# EAGLE design Thing_Plus_MGM240P (EAGLE 9.6.2)
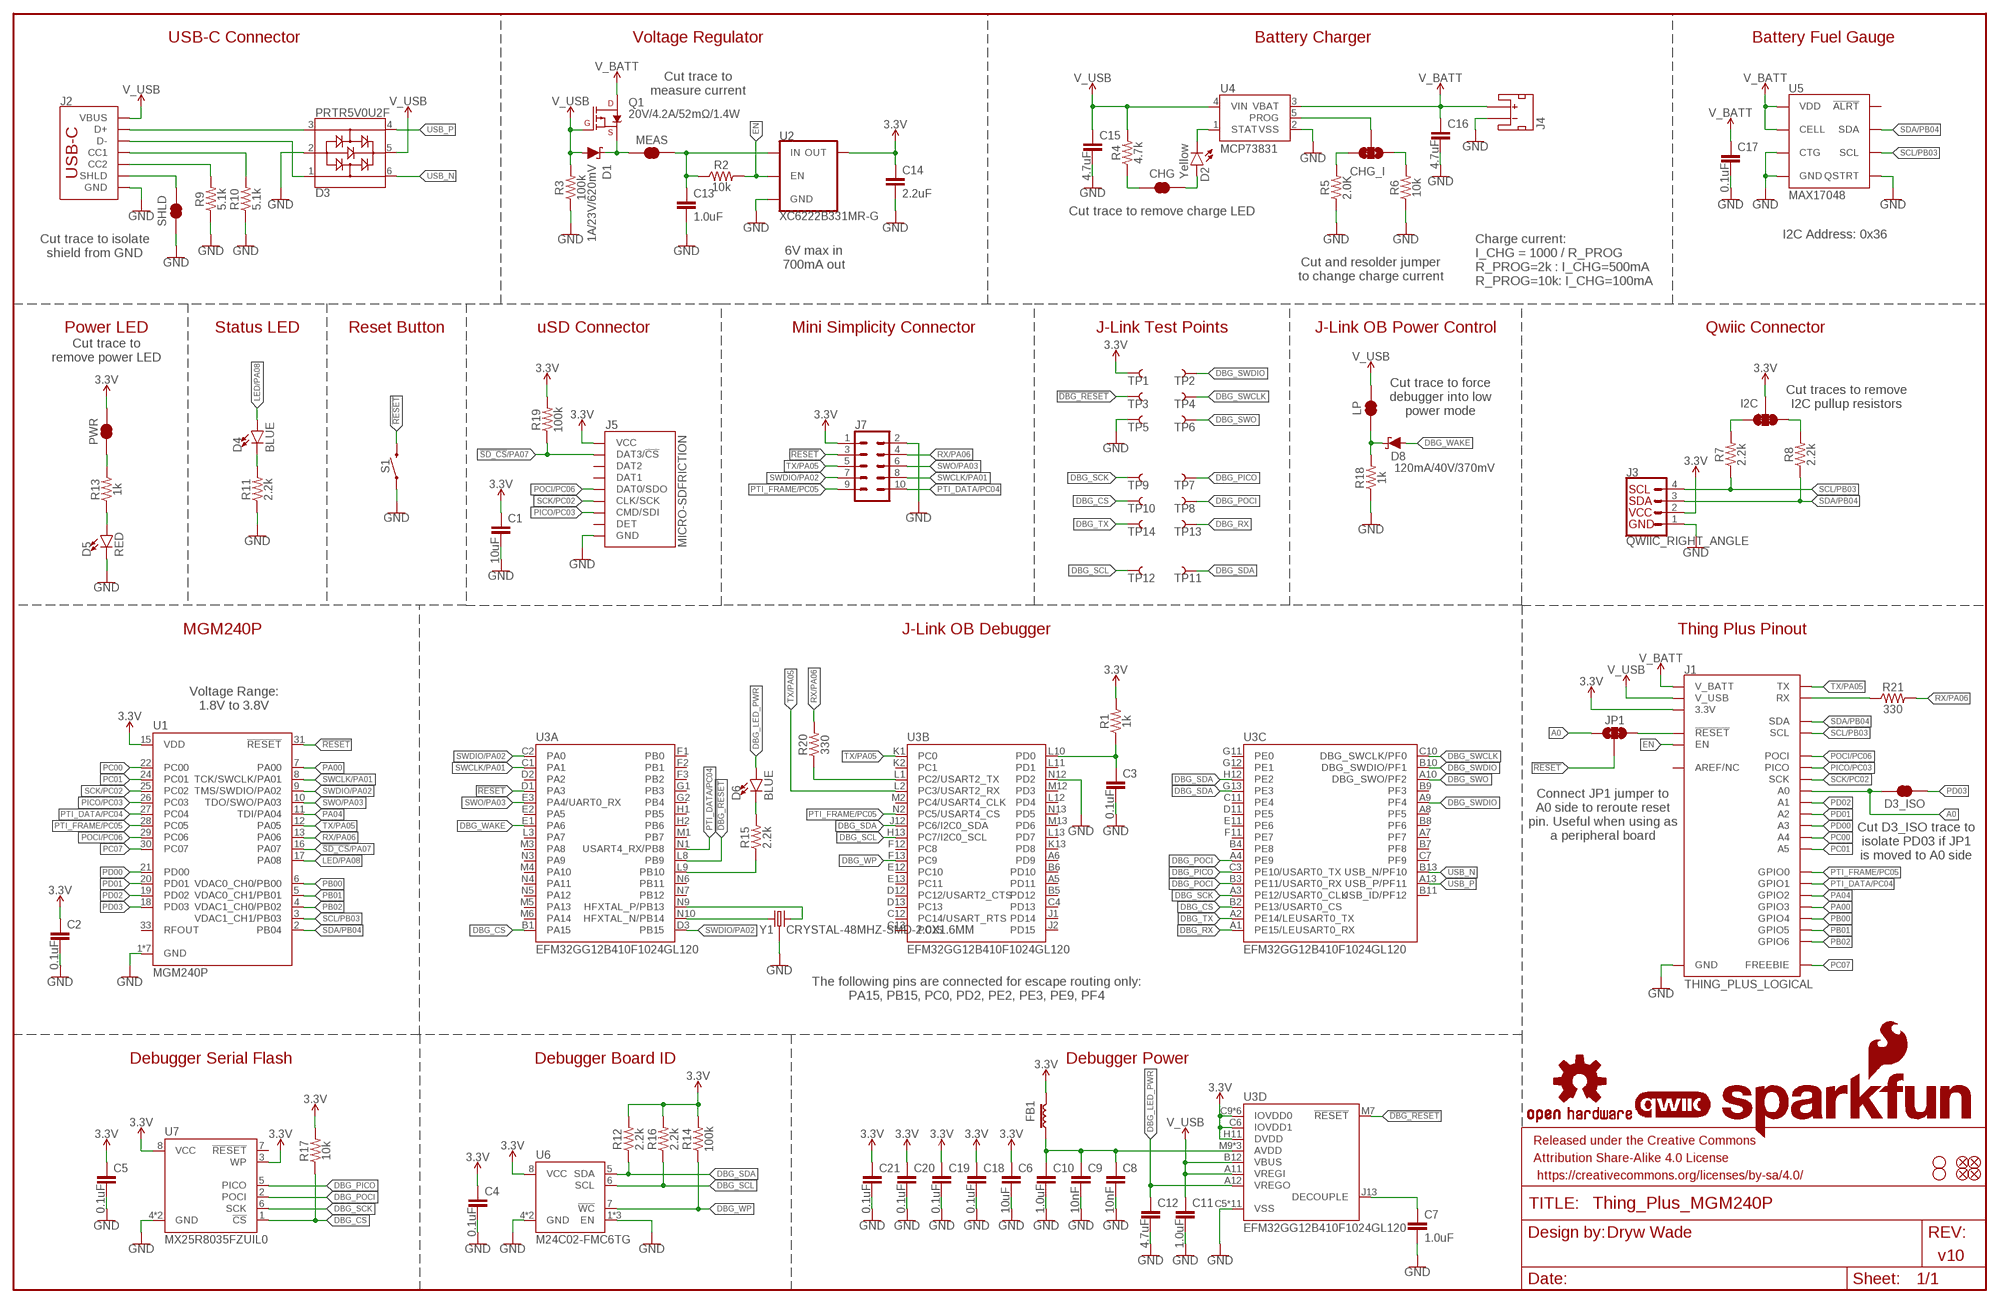
[diagram p0: schematic, sheet 1]

## Parts
C1  10uF  10UF-0402T-6.3V-20%  [0402-TIGHT]
C2  0.1uF  0.1UF-0402T-6.3V-10%-X7R  [0402-TIGHT]
C3  0.1uF  0.1UF-0402T-6.3V-10%-X7R  [0402-TIGHT]
C4  0.1uF  0.1UF-0402T-6.3V-10%-X7R  [0402-TIGHT]
C5  0.1uF  0.1UF-0402T-6.3V-10%-X7R  [0402-TIGHT]
C6  10uF  10UF-0402T-6.3V-20%  [0402-TIGHT]
C7  1.0uF  1.0UF-0603-16V-10%-X7R  [0603]
C8  10nF  10NF-0402T-25V-10%  [0402-TIGHT]
C9  10nF  10NF-0402T-25V-10%  [0402-TIGHT]
C10  1.0uF  1.0UF-0402T-16V-10%  [0402-TIGHT]
C11  1.0uF  1.0UF-0402T-16V-10%  [0402-TIGHT]
C12  4.7uF  4.7UF-0402_TIGHT-6.3V-20%-X5R  [0402-TIGHT]
C13  1.0uF  1.0UF-0402T-16V-10%  [0402-TIGHT]
C14  2.2uF  2.2UF-0402_TIGHT-10V-10%-X5R  [0402-TIGHT]
C15  4.7uF  4.7UF-0402_TIGHT-6.3V-20%-X5R  [0402-TIGHT]
C16  4.7uF  4.7UF-0402_TIGHT-6.3V-20%-X5R  [0402-TIGHT]
C17  0.1uF  0.1UF-0402T-6.3V-10%-X7R  [0402-TIGHT]
C18  0.1uF  0.1UF-0402T-6.3V-10%-X7R  [0402-TIGHT]
C19  0.1uF  0.1UF-0402T-6.3V-10%-X7R  [0402-TIGHT]
C20  0.1uF  0.1UF-0402T-6.3V-10%-X7R  [0402-TIGHT]
C21  0.1uF  0.1UF-0402T-6.3V-10%-X7R  [0402-TIGHT]
CHG  JUMPER-SMT_2_NC_TRACE_SILK  [SMT-JUMPER_2_NC_TRACE_SILK]
CHG_I  JUMPER-SMT_3_1-NC_TRACE_SILK  [SMT-JUMPER_3_1-NC_TRACE_SILK]
D1  1A/23V/620mV  DIODE-SCHOTTKY-BAT20J  [SOD-323]
D2  Yellow  LED-YELLOW0603  [LED-0603]
D3  PRTR5V0U2F  [SOT886]
D3_ISO  JUMPER-SMT_2_NC_TRACE_SILK  [SMT-JUMPER_2_NC_TRACE_SILK]
D4  BLUE  LED-BLUE0603  [LED-0603]
D5  RED  LED-RED0603  [LED-0603]
D6  BLUE  LED-BLUE0603  [LED-0603]
D8  120mA/40V/370mV  DIODE-SCHOTTKY-RB751S40  [SOD-523]
FB1  FERRITE_BEAD-120_OHM-0402T  [0402-TIGHT]
FD1  FIDUCIAL1X2  [FIDUCIAL-1X2]
FD2  FIDUCIAL1X2  [FIDUCIAL-1X2]
FD3  FIDUCIAL1X2  [FIDUCIAL-1X2]
FD4  FIDUCIAL1X2  [FIDUCIAL-1X2]
FRAME1  FRAME-LEDGER  [CREATIVE_COMMONS]
H1  STAND-OFF  [STAND-OFF]
H2  STAND-OFF  [STAND-OFF]
I2C  JUMPER-SMT_3_2-NC_TRACE_SILK  [SMT-JUMPER_3_2-NC_TRACE_SILK]
J1  THING_PLUS_LOGICAL  [THING_PLUS]
J2  USB Female Type C Connector  USB_C_4-LAYER-ISOLATED  [USB-C-16P-4LAYER-ISOLATED]
J3  QWIIC_RIGHT_ANGLE  QWIIC_CONNECTORJS-1MM  [JST04_1MM_RA]
J4  JST_2MM_MALE  [JST-2-SMD]
J5  MICRO-SDFRICTION  [MICROSD_TINY]
J7  CONN_05X20.05_IN_PTH_SILK  [2X5_PTH_SILK_.05]
JP1  JUMPER-SMT_3_1-NC_TRACE_SILK  [SMT-JUMPER_3_1-NC_TRACE_SILK]
LOGO1  SFE_LOGO_NAME_FLAME.1_INCH  [SFE_LOGO_NAME_FLAME_.1]
LOGO2  QWIIC_LOGO_3MM  [QWIIC_3MM]
LOGO3  OSHW-LOGOS  [OSHW-LOGO-S]
LP  JUMPER-SMT_2_NC_TRACE_SILK  [SMT-JUMPER_2_NC_TRACE_SILK]
MEAS  JUMPER-COMBO_2_NC_TRACE  [COMBO-JUMPER_2_NC_TRACE]
PWR  JUMPER-SMT_2_NC_TRACE_SILK  [SMT-JUMPER_2_NC_TRACE_SILK]
Q1  20V/4.2A/52mΩ/1.4W  MOSFET_PCH-DMG2305UX-7  [SOT23-3]
R1  1k  1KOHM-0402T-1/16W-1%  [0402-TIGHT]
R2  10k  10KOHM-0402T-1/16W-1%  [0402-TIGHT]
R3  100k  100KOHM-0402T-1/16W-1%  [0402-TIGHT]
R4  4.7k  4.7KOHM-0402T-1/16W-1%  [0402-TIGHT]
R5  2.0K  2.0KOHM-0402T-1/16W-1%  [0402-TIGHT]
R6  10k  10KOHM-0402T-1/16W-1%  [0402-TIGHT]
R7  2.2k  2.2KOHM-0402T-1/16W-1%  [0402-TIGHT]
R8  2.2k  2.2KOHM-0402T-1/16W-1%  [0402-TIGHT]
R9  5.1k  5.1KOHM-0402T-1/16W-1%  [0402-TIGHT]
R10  5.1k  5.1KOHM-0402T-1/16W-1%  [0402-TIGHT]
R11  2.2k  2.2KOHM-0402T-1/16W-1%  [0402-TIGHT]
R12  2.2k  2.2KOHM-0402T-1/16W-1%  [0402-TIGHT]
R13  1k  1KOHM-0402T-1/16W-1%  [0402-TIGHT]
R14  100k  100KOHM-0402T-1/16W-1%  [0402-TIGHT]
R15  2.2k  2.2KOHM-0402T-1/16W-1%  [0402-TIGHT]
R16  2.2k  2.2KOHM-0402T-1/16W-1%  [0402-TIGHT]
R17  10k  10KOHM-0402T-1/16W-1%  [0402-TIGHT]
R18  1k  1KOHM-0402T-1/16W-1%  [0402-TIGHT]
R19  100k  100KOHM-0402T-1/16W-1%  [0402-TIGHT]
R20  330  330OHM-0402T-1/16W-5%  [0402-TIGHT]
R21  330  330OHM-0402T-1/16W-5%  [0402-TIGHT]
S1  MOMENTARY-SWITCH-SPST-SMD-4.6X2.8MM  [TACTILE_SWITCH_SMD_4.6X2.8MM]
SHLD  JUMPER-SMT_2_NC_TRACE_SILK  [SMT-JUMPER_2_NC_TRACE_SILK]
TP1  TEST-POINT3  [PAD.03X.03]
TP2  TEST-POINT3  [PAD.03X.03]
TP3  TEST-POINT3  [PAD.03X.03]
TP4  TEST-POINT3  [PAD.03X.03]
TP5  TEST-POINT3  [PAD.03X.03]
TP6  TEST-POINT3  [PAD.03X.03]
TP7  TEST-POINT3  [PAD.03X.03]
TP8  TEST-POINT3  [PAD.03X.03]
TP9  TEST-POINT3  [PAD.03X.03]
TP10  TEST-POINT3  [PAD.03X.03]
TP11  TEST-POINT3  [PAD.03X.03]
TP12  TEST-POINT3  [PAD.03X.03]
TP13  TEST-POINT3  [PAD.03X.03]
TP14  TEST-POINT3  [PAD.03X.03]
U1  MGM240P  [MGM240P]
U2  XC6222B331MR-G  [SOT23-5]
U3  EFM32GG12B410F1024GL120  [BGA120]
U4  MCP73831  [SOT23-5]
U5  MAX17048  MAX17048DFN8  [DFN-8]
U6  M24C02-FMC6TG  [DFN8_2X3MM]
U7  MX25R8035FZUIL0  [USON-8_2X3MM]
Y1  CRYSTAL-48MHZ-SMD-2.0X1.6MM  [CRYSTAL-SMD-2.0X1.6MM-ECS]

## Nets
3.3V: C1.1 C2.1 C4.1 C5.1 C6.1 C14.1 C18.1 C19.1 C20.1 C21.1 FB1.2 I2C.2 J1.27(3.3V) J3.2 J5.4(VCC) J7.1 PWR.2 R1.2 R12.2 R14.2 R16.2 R17.2 R19.2 TP1.1 U1.15(VDD) U2.5(OUT) U3.C6(D:IOVDD1) U3.C9(D:IOVDD0) U3.G3(D:IOVDD0) U3.H11(D:DVDD) U3.J11(D:IOVDD0) U3.K3(D:IOVDD0) U3.L4(D:IOVDD0) U3.L7(D:IOVDD0) U6.8(VCC) U7.3(WP) U7.8(VCC)
!DBG_RESET!: TP3.1 U3.L8(A:PB9) U3.M7(D:!RESET!)
!RESET!: J7.3 JP1.2 S1.3 S1.4 U1.31(!RESET!) U3.D1(A:PA3)
!SD_CS!/PA07: J5.2(DAT3/!CS!) R19.1 U1.16(PA07)
A0: D3_ISO.2 J1.24(A0) JP1.1
DBG_CS: R17.1 TP10.1 U3.B1(A:PA15) U3.B2(C:PE13/USART0_CS) U7.1(!CS!)
DBG_LED_PWR: C12.1 D6.A U3.A12(D:VREGO)
DBG_PICO: TP7.1 U3.C3(C:PE10/USART0_TX) U7.5(PICO)
DBG_POCI: TP8.1 U3.A4(C:PE9) U3.B3(C:PE11/USART0_RX) U7.2(POCI)
DBG_RX: TP13.1 U3.A1(C:PE15/LEUSART0_RX)
DBG_SCK: TP9.1 U3.A3(C:PE12/USART0_CLK) U7.6(SCK)
DBG_SCL: R16.1 TP12.1 U3.H13(B:PC7/I2C0_SCL) U6.6(SCL)
DBG_SDA: R12.1 TP11.1 U3.G13(C:PE3) U3.H12(C:PE2) U3.J12(B:PC6/I2C0_SDA) U6.5(SDA)
DBG_SWCLK: TP4.1 U3.C10(C:DBG_SWCLK/PF0)
DBG_SWDIO: TP2.1 U3.A9(C:PF4) U3.B10(C:DBG_SWDIO/PF1)
DBG_SWO: TP6.1 U3.A10(C:DBG_SWO/PF2)
DBG_TX: TP14.1 U3.A2(C:PE14/LEUSART0_TX)
DBG_WAKE: D8.A U3.E1(A:PA6)
DBG_WP: R14.1 U3.F13(B:PC9) U6.7(!WC!)
EN: J1.11(EN) R2.2 U2.3(EN)
GND: C1.2 C2.2 C3.2 C4.2 C5.2 C6.2 C7.2 C8.2 C9.2 C10.2 C11.2 C12.2 C13.2 C14.2 C15.2 C16.2 C17.2 C18.2 C19.2 C20.2 C21.2 D3.2 D5.C J1.25(GND) J2.GND J2.GND2(GND) J3.1 J4.1(-) J5.6(GND) J5.GND1(GND) J5.GND2(GND) J5.GND3(GND) J5.GND4(GND) J5.GND5(GND) J5.GND6(GND) J7.2 R3.1 R5.1 R6.1 R9.1 R10.1 R11.1 R18.1 S1.1 S1.2 SHLD.1 TP5.1 U1.1(GND) U1.14(GND) U1.23(GND) U1.32(GND) U1.34(GND) U1.35(GND) U1.36(GND) U2.2(GND) U3.C5(D:VSS) U3.C8(D:VSS) U3.H3(D:VSS) U3.J3(D:VSS) U3.K11(D:VSS) U3.K12(D:VSS) U3.L5(D:VSS) U3.L6(D:VSS) U3.M8(D:VSS) U3.M11(D:VSS) U3.N8(D:VSS) U3.N12(B:PD2) U4.2(VSS) U5.1(CTG) U5.4(GND) U5.6(QSTRT) U5.9(GND) U6.1(EN) U6.2(EN) U6.3(EN) U6.4(GND) U6.EPAD(GND) U7.4(GND) U7.EPAD(GND) Y1.2(GND) Y1.4(GND)
LED/PA08: D4.A U1.17(PA08)
N$1: D4.C R11.2
N$2: PWR.1 R13.2
N$3: CHG.2 D2.A
N$4: CHG_I.1 R6.2
N$5: D2.C U4.1(STAT)
N$6: CHG_I.3 R5.2
N$7: D1.C MEAS.1 MEAS.3 Q1.2(S)
N$8: D5.A R13.1
N$9: CHG_I.2 U4.5(PROG)
N$10: CHG.1 R4.1
N$11: I2C.3 R7.2
N$12: C3.1 R1.1 U3.L10(B:PD0)
N$13: I2C.1 R8.2
N$14: J2.B5(CC2) R9.2
N$15: J2.A5(CC1) R10.2
N$16: D3.3 J2.A6(D+) J2.B6(D+)
N$17: C7.1 U3.J13(D:DECOUPLE)
N$18: D3.1 J2.A7(D-) J2.B7(D-)
N$19: C8.1 C9.1 C10.1 FB1.1 U3.M9(D:AVDD) U3.M10(D:AVDD) U3.N11(D:AVDD)
N$20: R15.1 U3.L9(A:PB10)
N$21: D6.C R15.2
N$22: U3.N10(A:HFXTAL_N/PB14) Y1.1
N$23: U3.N9(A:HFXTAL_P/PB13) Y1.3
N$24: D8.C LP.1 R18.2
N$25: R20.1 U3.L1(B:PC2/USART2_TX)
N$26: J1.15(RX) R21.1
N$27: C13.1 MEAS.2 MEAS.4 R2.1 U2.1(IN)
N$28: J1.28(!RESET) JP1.3
PA00: J1.6(GPIO3) U1.7(PA00)
PA04: J1.7(GPIO2) U1.11(TDI/PA04)
PB00: J1.5(GPIO4) U1.6(VDAC0_CH0/PB00)
PB01: J1.4(GPIO5) U1.5(VDAC0_CH1/PB01)
PB02: J1.3(GPIO6) U1.4(VDAC1_CH0/PB02)
PC00: J1.20(A4) U1.22(PC00)
PC01: J1.19(A5) U1.24(PC01)
PC07: J1.13(FREEBIE) U1.30(PC07)
PD00: J1.21(A3) U1.21(PD00)
PD01: J1.22(A2) U1.20(PD01)
PD02: J1.23(A1) U1.19(PD02)
PD03: D3_ISO.1 U1.18(PD03)
PICO/PC03: J1.17(PICO) J5.3(CMD/SDI) U1.26(PC03)
POCI/PC06: J1.16(POCI) J5.7(DAT0/SDO) U1.29(PC06)
PTI_DATA/PC04: J1.8(GPIO1) J7.10 U1.27(PC04) U3.N1(A:USART4_RX/PB8)
PTI_FRAME/PC05: J1.9(GPIO0) J7.9 U1.28(PC05) U3.N2(B:PC5/USART4_CS)
RX/PA06: J7.4 R20.2 R21.2 U1.13(PA06)
SCK/PC02: J1.18(SCK) J5.5(CLK/SCK) U1.25(PC02)
SCL/PB03: J1.2(SCL) J3.4 R7.1 U1.3(VDAC1_CH1/PB03) U5.7(SCL)
SDA/PB04: J1.1(SDA) J3.3 R8.1 U1.2(PB04) U5.8(SDA)
SHLD: J2.SHLD1(SHLD) J2.SHLD2(SHLD) J2.SHLD3(SHLD) J2.SHLD4(SHLD) J2.SHLD5(SHLD) J2.SHLD6(SHLD) J2.SHLD7(SHLD) J2.SHLD8(SHLD) SHLD.2
SWCLK/PA01: J7.8 U1.8(TCK/SWCLK/PA01) U3.C1(A:PA1)
SWDIO/PA02: J7.7 U1.9(TMS/SWDIO/PA02) U3.C2(A:PA0) U3.D3(A:PB15)
SWO/PA03: J7.6 U1.10(TDO/SWO/PA03) U3.E3(A:PA4/UART0_RX)
TX/PA05: J1.14(TX) J7.5 U1.12(PA05) U3.K1(B:PC0) U3.L2(B:PC3/USART2_RX)
USB_N [USB]: D3.6 U3.B13(C:USB_N/PF10)
USB_P [USB]: D3.4 U3.A13(C:USB_P/PF11)
V_BATT: C16.1 C17.1 J1.12(V_BATT) J4.2(+) Q1.3(D) U4.3(VBAT) U5.2(CELL) U5.3(VDD)
V_USB: C11.1 C15.1 D1.A D3.5 J1.10(V_USB) J2.VBUS1(VBUS) J2.VBUS2(VBUS) LP.2 Q1.1(G) R3.2 R4.2 U3.A11(D:VREGI) U3.B12(D:VBUS) U4.4(VIN)
Unconnected: J1.26(AREF/NC) J4.NC1(PAD1) J4.NC2(PAD2) J5.1(DAT2) J5.8(DAT1) J5.9(DET) U1.33(RFOUT) U3.A5(B:PD11) U3.A6(B:PD9) U3.A7(C:PF7) U3.A8(C:PF5) U3.B4(C:PE8) U3.B5(B:PD12) U3.B6(B:PD10) U3.B7(C:PF8) U3.B8(C:PF6) U3.B9(C:PF3) U3.B11(C:USB_ID/PF12) U3.C4(B:PD13) U3.C7(C:PF9) U3.C11(C:PE4) U3.C12(B:PC14/USART_RTS) U3.C13(B:PC15) U3.D2(A:PA2) U3.D11(C:PE5) U3.D12(B:PC12/USART2_CTS) U3.D13(B:PC13) U3.E2(A:PA5) U3.E11(C:PE6) U3.E12(B:PC10) U3.E13(B:PC11) U3.F1(A:PB0) U3.F2(A:PB1) U3.F3(A:PB2) U3.F11(C:PE7) U3.F12(B:PC8) U3.G1(A:PB3) U3.G2(A:PB4) U3.G11(C:PE0) U3.G12(C:PE1) U3.H1(A:PB5) U3.H2(A:PB6) U3.J1(B:PD14) U3.J2(B:PD15) U3.K2(B:PC1) U3.K13(B:PD8) U3.L3(A:PA7) U3.L11(B:PD1) U3.L12(B:PD4) U3.L13(B:PD7) U3.M1(A:PB7) U3.M2(B:PC4/USART4_CLK) U3.M3(A:PA8) U3.M4(A:PA10) U3.M5(A:PA13) U3.M6(A:PA14) U3.M12(B:PD3) U3.M13(B:PD6) U3.N3(A:PA9) U3.N4(A:PA11) U3.N5(A:PA12) U3.N6(A:PB11) U3.N7(A:PB12) U3.N13(B:PD5) U5.5(!ALRT) U7.7(!RESET!)

## Notes on the sheet
- USB-C Connector | Voltage Regulator | Battery Charger | Battery Fuel Gauge
- Cut trace to
  measure current
- Cut trace to remove charge LED
- Charge current:
  I_CHG = 1000 / R_PROG
  R_PROG=2k : I_CHG=500mA
  R_PROG=10k: I_CHG=100mA
- I2C Address: 0x36
- Cut trace to isolate
  shield from GND
- 6V max in
  700mA out
- Cut and resolder jumper
  to change charge current
- Power LED | Status LED | Reset Button | uSD Connector | Mini Simplicity Connector | J-Link Test Points | J-Link OB Power Control | Qwiic Connector
- Cut trace to
  remove power LED
- Cut trace to force
  debugger into low
  power mode
- Cut traces to remove
  I2C pullup resistors
- MGM240P | J-Link OB Debugger | Thing Plus Pinout
- Voltage Range:
  1.8V to 3.8V
- Connect JP1 jumper to
  A0 side to reroute reset
  pin. Useful when using as
  a peripheral board
- Cut D3_ISO trace to
  isolate PD03 if JP1
  is moved to A0 side
- The following pins are connected for escape routing only:
  PA15, PB15, PC0, PD2, PE2, PE3, PE9, PF4
- Debugger Serial Flash | Debugger Board ID | Debugger Power
- Dryw Wade
- v10

## Library data of the parts
C1 C6 = SparkFun-Capacitors:10UF: 10.0µF ceramic capacitors A capacitor is a passive two-terminal electrical component used to store electrical energy temporarily in an electric field.; PROD_ID: CAP-14848
C2-C5 C17-C21 = SparkFun-Capacitors:0.1UF: 0.1µF ceramic capacitors A capacitor is a passive two-terminal electrical component used to store electrical energy temporarily in an electric field.; PROD_ID: CAP-14993
C7 = SparkFun-Capacitors:1.0UF: 1µF ceramic capacitors A capacitor is a passive two-terminal electrical component used to store electrical energy temporarily in an electric field.; PROD_ID: CAP-13930
C8 C9 = SparkFun-Capacitors:10NF: 0.01uF/10nF/10,000pF ceramic capacitors A capacitor is a passive two-terminal electrical component used to store electrical energy temporarily in an electric field. CAP-09321; PROD_ID: CAP-14847
C10 C11 C13 = SparkFun-Capacitors:1.0UF: 1µF ceramic capacitors A capacitor is a passive two-terminal electrical component used to store electrical energy temporarily in an electric field.; PROD_ID: CAP-12417
C12 C15 C16 = SparkFun-Capacitors:4.7UF: 4.7µF ceramic capacitors A capacitor is a passive two-terminal electrical component used to store electrical energy temporarily in an electric field.; PROD_ID: CAP-14240
C14 = SparkFun-Capacitors:2.2UF: 2.2µF ceramic capacitors A capacitor is a passive two-terminal electrical component used to store electrical energy temporarily in an electric field.; PROD_ID: CAP-14232
CHG D3_ISO LP PWR SHLD = SparkFun-Jumpers:JUMPER-SMT_2_NC_TRACE: Normally closed trace jumper This jumper has a trace between two pads so it's normally closed (NC). Use a razor knife to open the connection. For best results follow the IPC guidelines for cutting traces: Cutout at least 0.063 mm (0.005 in). Remove all loose material to clean up the cut area. Seal the cut with an approved epoxy. Reapply solder to reclose the connection.
CHG_I JP1 = SparkFun-Jumpers:JUMPER-SMT_3_1-NC_TRACE: Normally closed trace jumper (1 of 2 connections) This jumper has a trace between two pads so it's normally closed (NC). The other connection is normally open (NO). Use a razor knife to open the connection. For best results follow the IPC guidelines for cutting traces: Cutout at least 0.063 mm (0.005 in). Remove all loose material to clean up the cut area. Seal the cut with an approved epoxy. Reapply solder to reclose the connection, or to close the NO connection.
D1 = SparkFun-DiscreteSemi:DIODE-SCHOTTKY: Schottky diode A Schottky diode is a semiconductor diode which has a low forward voltage drop and a very fast switching action.; PROD_ID: DIO-11623
D2 = SparkFun-LED:LED-YELLOW: Yellow SMD LED Used in manufacturing several products at SparkFun. Packages: 0603 - SMD 0603 package[Product Link] <http://www.kingbrightusa.com/product.asp?catalog_name=LED&product_id=APT1608SYCK> 0603 -SMART - SMART SMD 0603 package (more efficient/more expensive) [Product Link] <http://www.osram-os.com/osram_os/en/products/product-catalog/led-light-emitting-diodes/smartled-0603/ly-l29k/index.jsp> LilyPad - SMD1206 package[Product Datasheet] <https://www.sparkfun.com/datasheets/DevTools/LilyPad/Q150YUS4.pdf> SparkFun Products: Blynk Board <https://www.sparkfun.com/products/13794> IOIO-OTG <https://www.sparkfun.com/products/13613> XBee Explorer Serial <https://www.sparkfun.com/products/13225>; PROD_ID: DIO-09003
D3 = SparkFun-IC-Power:PRTR5V0U2: A small ESD protection device. Most commonly used on USB D+/D- signals to protect large, expensive, or especially sensitive USB enabled devices.; PROD_ID: DIO-14084
D4 D6 = SparkFun-LED:LED-BLUE: Blue SMD LED Used in manufacturing of various products at SparkFun Packages: 0603 - SMD 0603 package [Product Link] <http://www.digikey.com/product-detail/en/SMLE12BC7TT86/511-1589-2-ND/1641808> 1206 - SMD1206 package [Product Link] <http://www.digikey.com/product-detail/en/lite-on-inc/LTST-C150TBKT/160-1643-1-ND/573584> SparkFun Products: ESP8266 Thing-Dev Board <https://www.sparkfun.com/products/13711> RedBoard <https://www.sparkfun.com/products/12757>; PROD_ID: DIO-08575
D5 = SparkFun-LED:LED-RED: Red SMD LED Used in manufacturing of most products at SparkFun Packages: 0603 - SMD 0603 package [Product Link] <http://docs.avagotech.com/docs/AV02-0551EN> 0603 SMART - SMD 0603 SMART package ( more efficient and expensive)[Product Link] <http://www.osram-os.com/Graphics/XPic2/00077099_0.pdf> 1206 - SMD1206 package [Product Link] <https://www.sparkfun.com/datasheets/DevTools/LilyPad/Q150OVS4.pdff> SparkFun Products: Pro Mini 328 -5V <https://www.sparkfun.com/products/821> RedBoard <https://www.sparkfun.com/products/12757> IOIO-OTG <https://www.sparkfun.com/products/13613>; PROD_ID: DIO-00819
D8 = SparkFun-DiscreteSemi:DIODE-SCHOTTKY: Schottky diode A Schottky diode is a semiconductor diode which has a low forward voltage drop and a very fast switching action.; PROD_ID: DIO-11018
FB1 = SparkFun-Coils:FERRITE_BEAD-120_OHM: Ferrite Bead (blocks, cores, rings, chokes, etc.) Inductor with layers of ferrite used to suppress high frequencies. Often used to isolate high frequency noise.; PROD_ID: NDUC-14206
FD1-FD4 = SparkFun-Aesthetics:FIDUCIAL: Fiducial Alignment Points Point-of-reference for pick-and-place machines and other optical instruments.
FRAME1 = SparkFun-Aesthetics:FRAME-LEDGER: Schematic Frame - Ledger Standard 11x14 US Ledger frame
H1 H2 = SparkFun-Hardware:STAND-OFF: Stand Off Drill holes for mechanically mounting via screws, standoffs, etc. Note: Use the keepout ring to avoid running the screw head into surrounding components. Variant Overviews STAND-OFF - Mechanical footprint for a #4 phillips button head screw. STAND-OFF-TIGHT - Mechanical footprint for a #4 phillips button head screw, Example SparkFun Products Screw - Phillips Head (1/4", 4-40, 10 pack) <https://www.sparkfun.com/products/10453> (PRT-10453) Screw - Phillips Head (1/2", 4-40, 10 pack) <https://www.sparkfun.com/products/10452> (PRT-10452) Screw - Phillips Head (3/4", 4-40, 10 pack) <https://www.sparkfun.com/products/10451> (PRT-10451) Screw - Phillips Head (1", 4-40, 10 pack) <https://www.sparkfun.com/products/10450> (PRT-10450)
I2C = SparkFun-Jumpers:JUMPER-SMT_3_2-NC_TRACE: Normally closed trace jumper (2 of 2 connections) This jumper has a trace between all three pads so they are normally closed (NC). Use a razor knife to open the connection(s). For best results follow the IPC guidelines for cutting traces: Cutout at least 0.063 mm (0.005 in). Remove all loose material to clean up the cut area. Seal the cut with an approved epoxy. Reapply solder to reclose the connection(s).
J1 = SparkFun-Boards:THING_PLUS_LOGICAL
J2 = SparkFun-Connectors:USB_C: USB Type C 16Pin Connector Super Speed pins not available on the 16-pin purely SMD connector so this part is best for USB 2.0 implementations. D1 and D2 are tied together enabling D+/- no matter which way the cable is plugged into the connector. The two channel configuration pins (CC1/2) are exposed. These are normally connected to ground via 5.1k resistors but can be reconfigured for high current/high power applications. **4-LAYER BOARD WARNING!!** If designing 4-layer board, make sure to select the variant _4-LAYER-ISOLATED. The linked footprint (USB-C-16-4LAYER-ISOLATED) includes some very necessary cutout polygons in the inner layers (2 and 15). This prevents the PTH mounting shield legs on the USB connector from electrically connecting any other polygons on the inner layers (usually VCC and GND).; PROD_ID: CONN-14122
J3 = SparkFun-Connectors:QWIIC_CONNECTOR: SparkFun I2C Standard Qwiic Connector An SMD 1mm pitch JST connector makes it easy and quick (get it? Qwiic?) to connect I2C devices to each other. The Qwiic system <http://www.sparkfun.com/qwiic> enables fast and solderless connection between popular platforms and various sensors and actuators. We carry 200mm <https://www.sparkfun.com/products/14204>, 100mm <https://www.sparkfun.com/products/14205>, 50mm <https://www.sparkfun.com/products/14206>, and breadboard friendly <https://www.sparkfun.com/products/14207> Qwiic cables. We also offer 10 pcs strips <https://www.sparkfun.com/products/14323> the SMD connectors.; PROD_ID: CONN-13694
J4 = SparkFun-Connectors:JST_2MM_MALE: JST 2MM MALE RA CONNECTOR Two pin, compact surface mount connector. Commonly used as a battery input connection point. We really like the solid locking feeling and high current rating on these small connectors. We use these all the time as battery connectors. Mates to single-cell LiPo batteries. Here is the connector we sell at SparkFun: JST Right Angle Connector - White <https://www.sparkfun.com/products/8612> (PRT-08612) Datasheet <http://www.sparkfun.com/datasheets/Prototyping/Connectors/JST-Horizontal.pdf> It was used on these SparkFun products: SparkFun MOSFET Power Controller <https://www.sparkfun.com/products/11214> (PRT-11214) SparkFun Battery Babysitter - LiPo Battery Manager <https://www.sparkfun.com/products/13777> (PRT-13777) And many, many others that required a lipo battery connection.; PROD_ID: CONN-11443; SF_ID: PRT-08612
J5 = SparkFun-Connectors:MICRO-SD: microSD Socket for Transflash Various sockets for µSD. tDoc lines correctly indicate media card edge positions when inserting (unlocked, locked, depressed). NOTE: CD1 and CD2 are connected internally, and the default detect state of the socket is detect pin to ground. SparkFun Products: WAV Trigger <https://www.sparkfun.com/products/13660> CAN-Bus Shield <https://www.sparkfun.com/products/13262> SparkFun Level Shifing microSD Breakout <https://www.sparkfun.com/products/13743>; PROD_ID: CONN-13500
J7 = SparkFun-Connectors:CONN_05X2: Multi connection point. Often used as Generic Header-pin footprint for 0.1 inch spaced/style header connections For AVR SPI programming port, see special device with nice symbol: "AVR_SPI_PROG_5x2.dev" You can populate with any combo of single row headers, but if you'd like an exact match, check these: 2x5 AVR ICSP Male Header <https://www.sparkfun.com/products/778> (PRT-00778) 2x5 Pin Shrouded Header <https://www.sparkfun.com/products/8506> (PRT-08506) On any of the 0.1 inch spaced packages, you can populate with these: Break Away Headers - Straight <https://www.sparkfun.com/products/116> (PRT-00116) Break Away Male Headers - Right Angle <https://www.sparkfun.com/products/553> (PRT-00553) Female Headers <https://www.sparkfun.com/products/115> (PRT-00115) Break Away Headers - Machine Pin <https://www.sparkfun.com/products/117> (PRT-00117) Break Away Female Headers - Swiss Machine Pin <https://www.sparkfun.com/products/743> (PRT-00743) Special note: the shrouded connector mates well with our 5x2 ribbon cables: 2x5 Pin IDC Ribbon Cable <https://www.sparkfun.com/products/8535> (PRT-08535)
LOGO1 = SparkFun-Aesthetics:SFE_LOGO_NAME_FLAME: SparkFun Font Logo w/ Flame This is the SparkFun full logo. The logo on the schematic will always be the same size; the package variant is the height of the flame part of the logo. Default layer for the logo on the board is tSilk.
LOGO2 = SparkFun-Aesthetics:QWIIC_LOGO: Qwiic Logos for placement on schematic and PCB. The 5.5mm silk logo is best for placing next to Qwiic connector.
LOGO3 = SparkFun-Aesthetics:OSHW-LOGO: Open-Source Hardware (OSHW) Logo This logo indicates the piece of hardware it is found on incorporates a OSHW license and/or adheres to the definition of open source hardware found here: http://freedomdefined.org/OSHW
MEAS = SparkFun-Jumpers:JUMPER-COMBO_2_NC_TRACE
Q1 = SparkFun-DiscreteSemi:MOSFET_PCH: P-channel MOSFETs Voltage controlled devices that allow control of high current outputs. SparkFun Products: SparkFun ESP32 Thing <https://www.sparkfun.com/products/13907> SparkFun ESP8266 Thing <https://www.sparkfun.com/products/13231> SparkFun Pi Servo HAT V2 <https://www.sparkfun.com/products/15316> DMG2305UX-7 (20V/4.2A/SOT23-3); PROD_ID: TRANS-14388
R1 R13 R18 = SparkFun-Resistors:1KOHM: 1kΩ resistor A resistor is a passive two-terminal electrical component that implements electrical resistance as a circuit element. Resistors act to reduce current flow, and, at the same time, act to lower voltage levels within circuits. - Wikipedia; PROD_ID: RES-14342
R2 R6 R17 = SparkFun-Resistors:10KOHM: 10kΩ resistor A resistor is a passive two-terminal electrical component that implements electrical resistance as a circuit element. Resistors act to reduce current flow, and, at the same time, act to lower voltage levels within circuits. - Wikipedia; PROD_ID: RES-14241
R3 R14 R19 = SparkFun-Resistors:100KOHM: 100kΩ resistor A resistor is a passive two-terminal electrical component that implements electrical resistance as a circuit element. Resistors act to reduce current flow, and, at the same time, act to lower voltage levels within circuits. - Wikipedia; PROD_ID: RES-13495
R4 = SparkFun-Resistors:4.7KOHM: 4.7kΩ resistor A resistor is a passive two-terminal electrical component that implements electrical resistance as a circuit element. Resistors act to reduce current flow, and, at the same time, act to lower voltage levels within circuits. - Wikipedia; PROD_ID: RES-15343
R5 = SparkFun-Resistors:2.0KOHM: 2kΩ resistor A resistor is a passive two-terminal electrical component that implements electrical resistance as a circuit element. Resistors act to reduce current flow, and, at the same time, act to lower voltage levels within circuits. - Wikipedia; PROD_ID: RES-15406
R7 R8 R11 R12 R15 R16 = SparkFun-Resistors:2.2KOHM: 2.2kΩ resistor A resistor is a passive two-terminal electrical component that implements electrical resistance as a circuit element. Resistors act to reduce current flow, and, at the same time, act to lower voltage levels within circuits. - Wikipedia; PROD_ID: RES-14341
R9 R10 = SparkFun-Resistors:5.1KOHM; PROD_ID: RES-14340
R20 R21 = SparkFun-Resistors:330OHM: 330Ω resistor A resistor is a passive two-terminal electrical component that implements electrical resistance as a circuit element. Resistors act to reduce current flow, and, at the same time, act to lower voltage levels within circuits. - Wikipedia; PROD_ID: RES-15407
S1 = SparkFun-Switches:MOMENTARY-SWITCH-SPST: Momentary Switch (Pushbutton) - SPST Normally-open (NO) SPST momentary switches (buttons, pushbuttons). Variants PTH-12MM - 12mm square, through-hole Momentary Pushbutton Switch - 12mm Square <https://www.sparkfun.com/products/9190> (COM-09190) PTH-6.0MM, PTH-6.0MM-KIT - 6.0mm square, through-hole Mini Pushbutton Switch <https://www.sparkfun.com/products/97> (COM-00097) KIT package intended for soldering kit's - only one side of pads' copper is exposed. PTH-RIGHT-ANGLE-KIT - Right-angle, through-hole Right Angle Tactile Button <https://www.sparkfun.com/products/10791> - Used on SparkFun BigTime Watch Kit <https://www.sparkfun.com/products/11734> SMD-12MM - 12mm square, surface-mount Tactile Button - SMD (12mm) <https://www.sparkfun.com/products/12993> (COM-12993) Used on SparkFun PicoBoard <https://www.sparkfun.com/products/11888> SMD-4.5MM - 4.5mm Square Trackball Switch Used on SparkFun Blackberry Trackballer Breakout <https://www.sparkfun.com/products/13169> SMD-4.6MMX2.8MM - 4.60mm x 2.80mm, surface mount Used on SparkFun Pro Micro - RP2040 <https://www.sparkfun.com/products/17717> SMD-5.2MM, SMD-5.2-REDUNDANT - 5.2mm square, surface-mount Mini Pushbutton Switch - SMD <https://www.sparkfun.com/products/8720> (COM-08720) Used on Arduino Pro Mini <https://www.sparkfun.com/products/11114> REDUNDANT package connects both switch circuits together SMD-6.0X3.5MM - 6.0 x 3.5mm, surface mount Momentary Reset Switch SMD <https://www.sparkfun.com/products/8229> (COM-08229) SMD-6.2MM-TALL - 6.2mm square, surface mount Tactile Button - SMD (6mm) <https://www.sparkfun.com/products/12992> Used on SparkFun Digital Sandbox <https://www.sparkfun.com/products/12651> SMD-RIGHT-ANGLE - Right-angle, surface mount Used on SparkFun Block for Intel® Edison - Arduino <https://www.sparkfun.com/products/13036>; PROD_ID: SWCH-15606
TP1-TP14 = SparkFun-Connectors:TEST-POINT: SparkFun Test Points Bare copper test points for troubleshooting or In-Circuit-Testing. These are used by our Production team for verifying production board runs using pogo-pins on test beds. SparkFun Products: SparkFun LSM9DS1 Breakout <https://www.sparkfun.com/products/13284> SparkFun PSOC <https://www.sparkfun.com/products/13714> SparkFun Load Cell Amplifier <https://www.sparkfun.com/products/13879>
U1 = SparkFun-RF:MGM240P: SiLabs MGM240P High performance wireless MCU Supports Zigbee, OpenThread, and BLE 26 GPIO pins Based on EFR32MG24 SoC 1.5MB Flash memory 256kB internal RAM; PROD_ID: IC-16860
U2 = SparkFun-IC-Power:XC6222; IOUT: 700mA; PROD_ID: VREG-16775; VOUT: 3.3V
U3 = SparkFun-IC-Microcontroller:EFM32GG12: SiLabs EFM32GG12 Energy efficient MCU. Used as a Segger debugger chip on some products. 93 GPIO pins 32-bit ARM Cortex-M4 processor 1MB Flash memory 192kB internal RAM Datasheet <https://www.silabs.com/documents/public/data-sheets/efm32gg12-datasheet.pdf>; PROD_ID: IC-16889
U4 = SparkFun-IC-Power:MCP73831: MCP73831T Li-Ion, Li-Pol Controller Miniature single cell, fully integrated Li-Ion, Li-polymer charge management controller Datasheet <http://ww1.microchip.com/downloads/en/DeviceDoc/20001984g.pdf> SparkFun Products: SparkFun ESP32 Thing <https://www.sparkfun.com/products/13907> SparkFun 9DoF Razor IMU M0 <https://www.sparkfun.com/products/14001>; PROD_ID: IC-09995
U5 = SparkFun-IC-Power:MAX17048: Micropower 1-Cell Li+ ModelGauge SparkFun Products Qduino Mini <https://www.sparkfun.com/products/13614> (DEV-13614); PROD_ID: IC-12551
U6 = SparkFun-IC-Memory:M24C02: STMicroelectronics M24C02 2k EEPROM 2k EEPROM I2C interface Write protection Datasheet <https://www.st.com/content/ccc/resource/technical/document/datasheet/b0/d8/50/40/5a/85/49/6f/DM00071904.pdf/files/DM00071904.pdf/jcr:content/translations/en.DM00071904.pdf>; PROD_ID: IC-16922
U7 = SparkFun-IC-Memory:MX25R8035F: Macronix MX25R8035F Serial Flash Low power 8Mb flash storage chip SPI interface 1-bit, 2-bit, and 4-bit storage structures Datasheet <https://www.macronix.com/Lists/Datasheet/Attachments/8749/MX25R8035F,%20Wide%20Range,%208Mb,%20v1.6.pdf>; PROD_ID: IC-16921
Y1 = SparkFun-Clocks:CRYSTAL-48MHZ: 48 MHz Crystal Digikey Link <https://www.digikey.com/en/products/detail/ecs-inc/ECS-480-10-37B2-RWN-TR/14663261> Crystal Attributes: Frequency: 48 MHz Frequency Stability: +/- 15ppm Frequency Tolerance: +/- 15ppm Load Capacitance: 10pF ESR: 40 Ohms Operating Mode: Fundamental PAD 2 and PAD 4 are GROUNDED; PROD_ID: XTAL-16925

## Net classes
1 USB: width 0.185 mm, clearance 0.127 mm

## Board
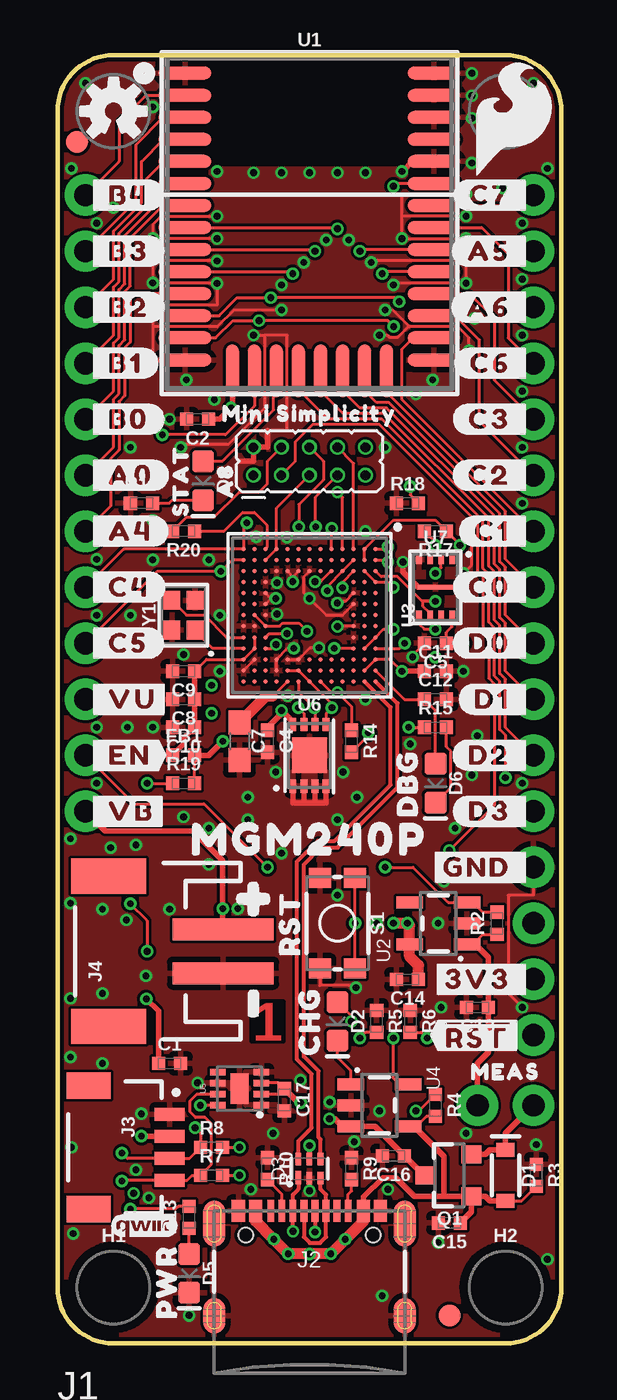
[diagram p1: board, top side]
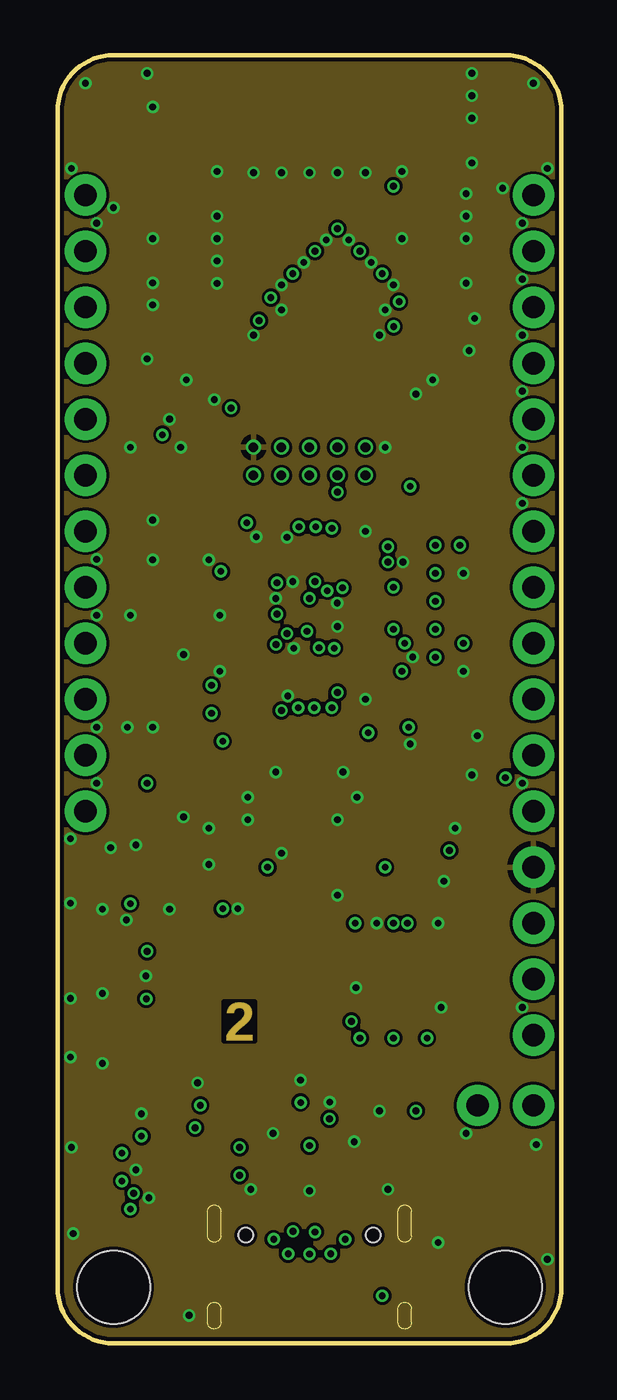
[diagram p2: board, inner layer GND]
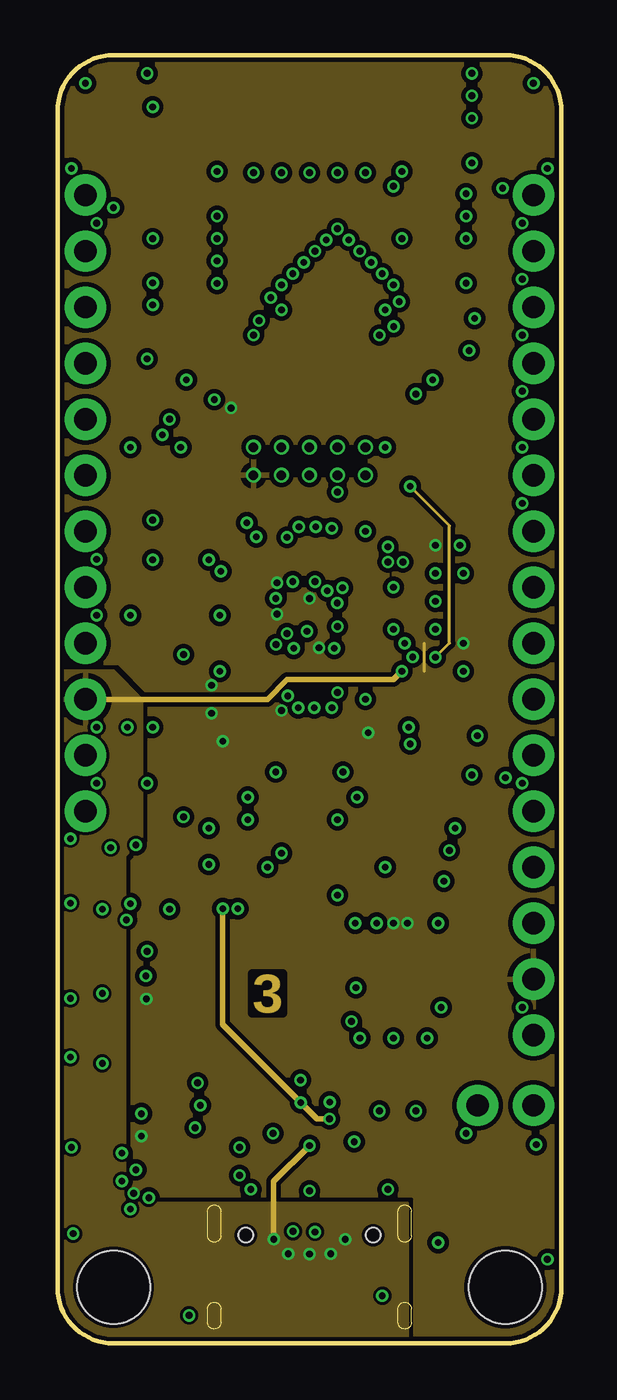
[diagram p3: board, inner layer PWR]
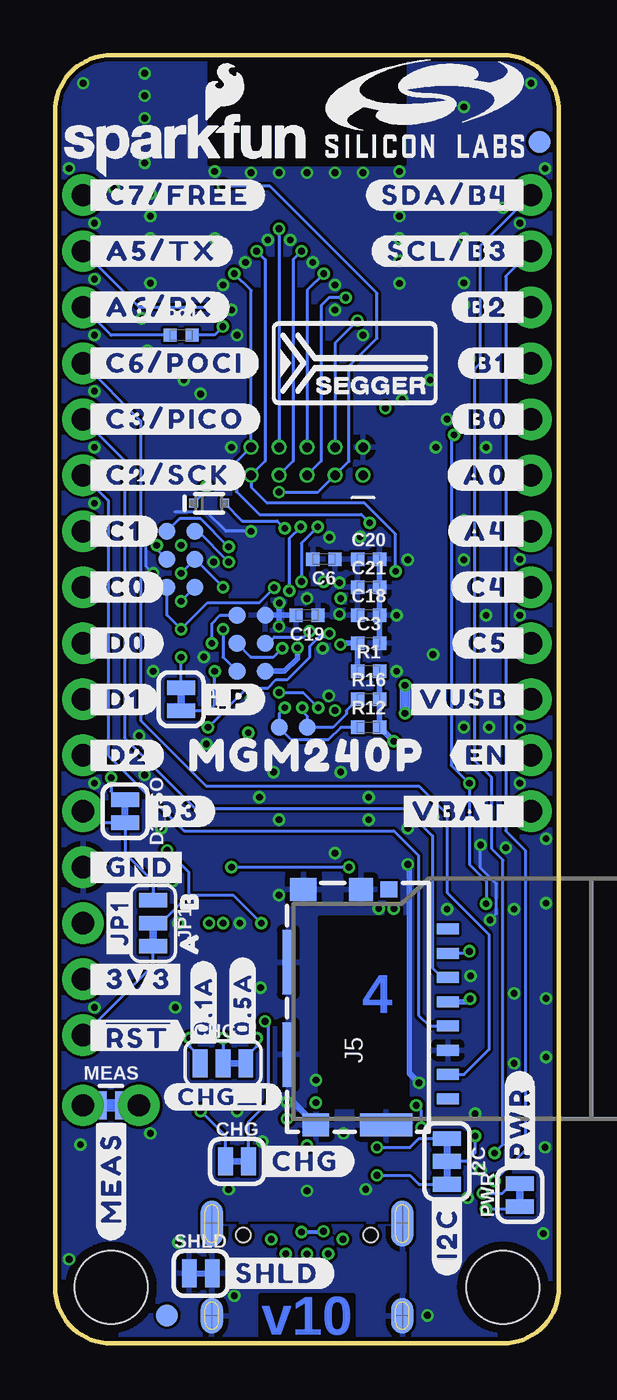
[diagram p4: board, bottom side, seen from below]

Size 22.86 x 58.42 mm. Coordinates in mm from the lower left corner, seen from the top.
Outline: 0,55.88 arc-90 2.54,58.42 20.32,58.42 arc-90 22.86,55.88 22.86,2.54 arc-90 20.32,0 2.54,0 arc-90 0,2.54 0,55.88
Copper layers (1*2*15*16): Top 0.035559375mm / dielectric 0.47751875mm / GND 0.035559375mm / dielectric 0.47751875mm / PWR 0.035559375mm / dielectric 0.47751875mm / Bottom 0.035559375mm
Design rules "SparkFun-4-Layer-Minimum-JLCPCB": minimum track width 5mil, minimum drill 0.2mm, track to track 5mil, track to pad 5mil, pad to pad 5mil, via to via 5mil, smd to smd 5mil, copper to edge 7mil, drill to drill 7mil, minimum pad ring 5mil, minimum via ring 5mil, stop-mask expansion 2.5mil, vias tented up to drill 25mil, thermal gap 10mil
tRestrict: area 16.9,57 to 17.3,57.1; area 16.9,56 to 17.3,56.1
bRestrict: area 9.8,44.2 to 9.9,44.3; area 10.4,45.2 to 10.5,45.3; area 11,46.9 to 11.2,47; area 11.7,47.6 to 11.8,47.8; area 12.3,49 to 12.4,49.1; area 13,49 to 13.1,49.1; area 13.6,47.6 to 13.7,47.8

### Footprints (pad centres in the part's own frame; a part is rotated, then mirrored left to right if it is on the bottom)
0402-TIGHT = smd 0.6 x 0.6: 1 -0.5,0; 2 0.5,0
0603 = smd 1.1 x 1: 1 -0.85,0; 2 0.85,0
SMT-JUMPER_2_NC_TRACE_SILK = smd 0.66 x 1.27: 1 -0.521,0; 2 0.521,0
SMT-JUMPER_3_1-NC_TRACE_SILK = smd 0.66 x 1.27: 1 -1.041,0; 2 0,0; 3 1.041,0
SOD-323 = smd 0.63 x 0.83: A 1.15,0; C -1.15,0
LED-0603 = smd 1 x 1: A -0.877,0; C 0.877,0
SOT886 = smd 0.61 x 0.25: 1 -0.405,0.5 | smd 0.56 x 0.25: 2 -0.43,0; 3 -0.43,-0.5; 4 0.43,-0.5; 5 0.43,0; 6 0.43,0.5
SOD-523 = smd 0.4 x 0.4: A -0.7,0; C 0.7,0
FIDUCIAL-1X2 = smd 1 x 1: 1 0,0
STAND-OFF = hole 3.302: 0,0
SMT-JUMPER_3_2-NC_TRACE_SILK = smd 0.66 x 1.27: 1 -1.041,0; 2 0,0; 3 1.041,0
THING_PLUS = drill 1.016 pad 1.88: 1 1.27,52.07; 2 1.27,49.53; 3 1.27,46.99; 4 1.27,44.45; 5 1.27,41.91; 6 1.27,39.37; 7 1.27,36.83; 8 1.27,34.29; 9 1.27,31.75; 10 1.27,29.21; 11 1.27,26.67; 12 1.27,24.13; 13 21.59,52.07; 14 21.59,49.53; 15 21.59,46.99; 16 21.59,44.45; 17 21.59,41.91; 18 21.59,39.37; 19 21.59,36.83; 20 21.59,34.29; 21 21.59,31.75; 22 21.59,29.21; 23 21.59,26.67; 24 21.59,24.13; 25 21.59,21.59; 26 21.59,19.05; 27 21.59,16.51; 28 21.59,13.97
USB-C-16P-4LAYER-ISOLATED = smd 0.3 x 1: A5 -1.25,-0.34; A6 -0.25,-0.34; A7 0.25,-0.34; A8 1.25,-0.34; B5 1.75,-0.34; B6 0.75,-0.34; B7 -0.75,-0.34; B8 -1.75,-0.34 | smd 0.6 x 1: GND -3.225,-0.34; GND2 3.225,-0.34; VBUS1 -2.45,-0.34; VBUS2 2.45,-0.34 | smd 1 x 2.1: SHLD1 -4.32,-0.915; SHLD2 4.32,-0.915 | smd 1 x 2.1 bottom: SHLD3 -4.32,-0.915; SHLD4 4.32,-0.915 | smd 1 x 1.6: SHLD5 -4.32,-5.095; SHLD8 4.32,-5.095 | smd 1 x 1.6 bottom: SHLD6 -4.32,-5.095; SHLD7 4.32,-5.095 | hole 0.65: -2.89,-1.445; 2.89,-1.445
JST04_1MM_RA = smd 0.6 x 1.35: 1 -1.5,0; 2 -0.5,0; 3 0.5,0; 4 1.5,0 | smd 1.2 x 2: NC1 2.8,-3.675; NC2 -2.8,-3.675
JST-2-SMD = smd 1 x 4.6: 1 -1,-3.7; 2 1,-3.7 | smd 1.6 x 3.4: NC1 -3.4,1.5; NC2 3.4,1.5
MICROSD_TINY = smd 0.5 x 1: 1 3.55,-3.85; 2 2.45,-3.85; 3 1.35,-3.85; 4 0.25,-3.85; 5 -0.85,-3.85; 6 -1.95,-3.85; 7 -3.05,-3.85; 8 -4.15,-3.85 | smd 0.72 x 0.78: 9 5.35,-1.17 | smd 1.05 x 1.08: GND1 5.35,0.1 | smd 1.05 x 1.2: GND2 5.35,2.71; GND3 -5.325,2.14 | smd 1.05 x 2.39: GND4 -5.325,-1.045 | smd 2.91 x 0.55: GND5 -2.145,3.385; GND6 2.045,3.385
2X5_PTH_SILK_.05 = drill 0.432: 1 0,0; 2 0,1.27; 3 1.27,0; 4 1.27,1.27; 5 2.54,0; 6 2.54,1.27; 7 3.81,0; 8 3.81,1.27; 9 5.08,0; 10 5.08,1.27
COMBO-JUMPER_2_NC_TRACE = smd 0.635 x 1.27: 1 -0.508,0; 2 0.508,0 | drill 1.016 pad 1.88: 3 -1.27,0; 4 1.27,0
SOT23-3 = smd 0.8 x 0.9: 1 -0.95,-1; 2 0.95,-1; 3 0,1.1
TACTILE_SWITCH_SMD_4.6X2.8MM = smd 0.9 x 1: 1 -2.05,-0.8; 2 2.05,-0.8; 3 2.05,0.8; 4 -2.05,0.8
PAD.03X.03 = smd 0.762 x 0.762: 1 0,0
MGM240P = smd 2.4 x 0.6: 1 -5.65,6.8; 2 -5.65,5.8; 3 -5.65,4.8; 4 -5.65,3.8; 5 -5.65,2.8; 6 -5.65,1.8; 7 -5.65,0.8; 8 -5.65,-0.2; 9 -5.65,-1.2; 10 -5.65,-2.2; 11 -5.65,-3.2; 12 -5.65,-4.2; 13 -5.65,-5.2; 14 -5.65,-6.2; 23 5.65,-6.2; 24 5.65,-5.2; 25 5.65,-4.2; 26 5.65,-3.2; 27 5.65,-2.2; 28 5.65,-1.2; 29 5.65,-0.2; 30 5.65,0.8; 31 5.65,1.8; 32 5.65,2.8; 33 5.65,3.8; 34 5.65,4.8; 35 5.65,5.8; 36 5.65,6.8 | smd 0.6 x 2.4: 15 -3.5,-6.7; 16 -2.5,-6.7; 17 -1.5,-6.7; 18 -0.5,-6.7; 19 0.5,-6.7; 20 1.5,-6.7; 21 2.5,-6.7; 22 3.5,-6.7
SOT23-5 = smd 0.55 x 1.2: 1 -0.95,-1.3; 2 0,-1.3; 3 0.95,-1.3; 4 0.95,1.3; 5 -0.95,1.3
BGA120 = smd 0.2 x 0.2: A1 -3,3; A2 -2.5,3; A3 -2,3; A4 -1.5,3; A5 -1,3; A6 -0.5,3; A7 0,3; A8 0.5,3; A9 1,3; A10 1.5,3; A11 2,3; A12 2.5,3; A13 3,3; B1 -3,2.5; B2 -2.5,2.5; B3 -2,2.5; B4 -1.5,2.5; B5 -1,2.5; B6 -0.5,2.5; B7 0,2.5; B8 0.5,2.5; B9 1,2.5; B10 1.5,2.5; B11 2,2.5; B12 2.5,2.5; B13 3,2.5; C1 -3,2; C2 -2.5,2; C3 -2,2; C4 -1.5,2; C5 -1,2; C6 -0.5,2; C7 0,2; C8 0.5,2; C9 1,2; C10 1.5,2; C11 2,2; C12 2.5,2; C13 3,2; D1 -3,1.5; D2 -2.5,1.5; D3 -2,1.5; D11 2,1.5; D12 2.5,1.5; D13 3,1.5; E1 -3,1; E2 -2.5,1; E3 -2,1; E11 2,1; E12 2.5,1; E13 3,1; F1 -3,0.5; F2 -2.5,0.5; F3 -2,0.5; F11 2,0.5; F12 2.5,0.5; F13 3,0.5; G1 -3,0; G2 -2.5,0; G3 -2,0; G11 2,0; G12 2.5,0; G13 3,0; H1 -3,-0.5; H2 -2.5,-0.5; H3 -2,-0.5; H11 2,-0.5; H12 2.5,-0.5; H13 3,-0.5; J1 -3,-1; J2 -2.5,-1; J3 -2,-1; J11 2,-1; J12 2.5,-1; J13 3,-1; K1 -3,-1.5; K2 -2.5,-1.5; K3 -2,-1.5; K11 2,-1.5; K12 2.5,-1.5; K13 3,-1.5; L1 -3,-2; L2 -2.5,-2; L3 -2,-2; L4 -1.5,-2; L5 -1,-2; L6 -0.5,-2; L7 0,-2; L8 0.5,-2; L9 1,-2; L10 1.5,-2; L11 2,-2; L12 2.5,-2; L13 3,-2; M1 -3,-2.5; M2 -2.5,-2.5; M3 -2,-2.5; M4 -1.5,-2.5; M5 -1,-2.5; M6 -0.5,-2.5; M7 0,-2.5; M8 0.5,-2.5; M9 1,-2.5; M10 1.5,-2.5; M11 2,-2.5; M12 2.5,-2.5; M13 3,-2.5; N1 -3,-3; N2 -2.5,-3; N3 -2,-3; N4 -1.5,-3; N5 -1,-3; N6 -0.5,-3; N7 0,-3; N8 0.5,-3; N9 1,-3; N10 1.5,-3; N11 2,-3; N12 2.5,-3; N13 3,-3
DFN-8 = smd 0.3 x 0.7: 1 -0.75,-0.99; 2 -0.25,-0.99; 3 0.25,-0.99; 4 0.75,-0.99; 5 0.75,0.99; 6 0.25,0.99; 7 -0.25,0.99; 8 -0.75,0.99 | smd 1.38 x 0.8: 9 0,0
DFN8_2X3MM = smd 0.3 x 0.6: 1 -0.75,-1.4; 2 -0.25,-1.4; 3 0.25,-1.4; 4 0.75,-1.4; 5 0.75,1.4; 6 0.25,1.4; 7 -0.25,1.4; 8 -0.75,1.4 | smd 1.6 x 1.6: EPAD 0,0
USON-8_2X3MM = smd 0.25 x 0.4: 1 0.75,1.25; 2 0.25,1.25; 3 -0.25,1.25; 4 -0.75,1.25; 5 -0.75,-1.25; 6 -0.25,-1.25; 7 0.25,-1.25; 8 0.75,-1.25 | smd 1.6 x 0.2: EPAD 0,0
CRYSTAL-SMD-2.0X1.6MM-ECS = smd 0.85 x 0.75: 1 -0.675,-0.525; 2 0.675,-0.525; 3 0.675,0.525; 4 -0.675,0.525

### Placement (x,y rotation side)
C1  5.08,12.7 0 top
C2  6.35,41.91 180 top
C3  8.64,31.75 0 bottom
C4  9.53,27.3 270 top
C5  17.14,31.75 180 top
C6  10.67,35.56 180 bottom
C7  8.26,27.3 270 top
C8  5.71,29.21 180 top
C9  5.71,30.48 180 top
C10  5.71,27.94 180 top
C11  17.14,30.48 0 top
C12  17.14,29.21 0 top
C13  19.05,15.24 180 top
C14  15.88,16.51 180 top
C15  17.78,5.46 180 top
C16  15.24,8.51 180 top
C17  10.29,11.05 270 top
C18  8.64,33.02 0 bottom
C19  11.43,33.02 180 bottom
C20  8.64,35.56 0 bottom
C21  8.64,34.29 0 bottom
CHG  14.61,8.26 0 bottom
CHG_I  15.24,12.7 0 bottom
D1  20.32,7.62 270 top
D2  12.7,14.61 270 top
D3  11.43,7.92 90 top
D3_ISO  19.68,24.13 270 bottom
D4  6.6,39.12 270 top
D5  5.97,3.17 270 top
D6  17.14,25.4 270 top
D8  15.88,38.1 180 bottom
FB1  5.71,26.67 0 top
FD1  0.89,54.48 0 bottom
FD2  0.89,54.48 0 top
FD3  17.78,1.27 0 top
FD4  17.78,1.27 0 bottom
FRAME1  -11.43,-22.86 0 top  (outside the outline)
H1  2.54,2.54 0 top
H2  20.32,2.54 0 top
I2C  5.08,8.26 270 bottom
J1  0,0 0 top
J2  11.43,6.35 0 top
J3  5.08,8.89 270 top
J4  3.81,17.78 90 top
J5  8.89,15.24 90 bottom
J7  8.89,39.37 0 top
JP1  18.41,19.05 270 bottom
LOGO1  16.89,54.36 0 bottom
LOGO2  3.94,5.33 0 top
LOGO3  2.54,55.88 0 top
LP  17.14,29.21 270 bottom
MEAS  20.32,10.79 0 bottom
PWR  1.78,6.73 90 bottom
Q1  17.78,7.62 90 top
R1  8.64,30.48 0 bottom
R2  19.94,19.05 90 top
R3  21.72,7.62 270 top
R4  17.14,10.79 270 top
R5  14.48,14.61 270 top
R6  16,14.61 270 top
R7  6.99,7.62 0 top
R8  6.99,8.89 0 top
R9  13.34,7.92 270 top
R10  9.53,7.92 270 top
R11  3.81,38.1 0 top
R12  8.64,27.94 0 bottom
R13  5.97,5.71 90 top
R14  13.34,27.3 270 top
R15  17.14,27.94 0 top
R16  8.64,29.21 0 bottom
R17  17.14,36.83 180 top
R18  15.88,38.1 0 top
R19  5.71,25.4 0 top
R20  5.71,36.83 180 top
R21  17.14,45.72 0 bottom
S1  12.7,19.05 270 top
SHLD  16.26,3.17 0 bottom
TP1  13.34,30.48 0 bottom
TP2  14.61,30.48 0 bottom
TP3  13.34,31.75 0 bottom
TP4  14.61,31.75 0 bottom
TP5  13.34,33.02 0 bottom
TP6  14.61,33.02 0 bottom
TP7  17.78,34.29 0 bottom
TP8  16.51,35.56 0 bottom
TP9  16.51,34.29 0 bottom
TP10  17.78,35.56 0 bottom
TP11  12.7,27.94 0 bottom
TP12  11.43,27.94 0 bottom
TP13  17.78,36.83 0 bottom
TP14  16.51,36.83 0 bottom
U1  11.43,50.8 0 top
U2  17.27,19.05 90 top
U3  11.43,33.02 270 top
U4  14.61,10.79 270 top
U5  8.26,11.56 90 top
U6  11.43,26.67 0 top
U7  17.14,34.29 0 top
U$1  [#_B4#0]  1.27,52.07 0 top
U$2  [#_B3#0]  1.27,49.53 0 top
U$3  [#_B2#0]  1.27,46.99 0 top
U$4  [#_B1#0]  1.27,44.45 0 top
U$5  [#SHLD#0]  15.37,3.17 0 bottom
U$6  [#_B0#0]  1.27,41.91 0 top
U$7  [#_A0#0]  1.27,39.37 0 top
U$8  [#_A4#0]  1.27,36.83 0 top
U$9  [#_C5#0]  1.27,31.75 0 top
U$10  [#_C4#0]  1.27,34.29 0 top
U$11  [#C7_#0]  21.59,52.07 0 top
U$12  [#A5_#0]  21.59,49.53 0 top
U$13  [#A6_#0]  21.59,46.99 0 top
U$14  [#C6_#0]  21.59,44.45 0 top
U$15  [#C3_#0]  21.59,41.91 0 top
U$16  [#C2_#0]  21.59,39.37 0 top
U$17  [#C1_#0]  21.59,36.83 0 top
U$18  [#C0_#0]  21.59,34.29 0 top
U$19  [#PWR#0]  1.78,7.62 90 bottom
U$20  [PWR0]  4.95,2.79 90 top
U$21  [#GND_#0]  21.59,21.59 0 top
U$22  [#3V3_#0]  21.59,16.51 0 top
U$23  [MGM240P0]  11.43,22.86 0 top
U$24  [#D0_#0]  21.59,31.75 0 top
U$25  [#_VB#0]  1.27,24.13 0 top
U$26  [#_VU#0]  1.27,29.21 0 top
U$27  [#_EN#0]  1.27,26.67 0 top
U$28  [##RST##0]  21.21,13.97 0 top
U$29  [SFE_LOGO_FLAME_.2]  20.7,55.5 0 top
U$30  [#0]  8.89,20.32 90 top
U$31  [#1]  8.89,15.24 270 top
U$32  [#D1_#0]  21.59,29.21 0 top
U$33  [#LP#0]  16.51,29.21 0 bottom
U$34  [#_A6#RX#0]  21.59,46.99 0 bottom
U$35  [#_C6#POCI#0]  21.59,44.45 0 bottom
U$36  [#_C3#PICO#0]  21.59,41.91 0 bottom
U$37  [#_C2#SCK#0]  21.59,39.37 0 bottom
U$38  [MINI_SIMPLICITY0]  11.43,42.16 0 top
U$39  [#_C1#0]  21.59,36.83 0 bottom
U$40  [#_C0#0]  21.59,34.29 0 bottom
U$41  [#_D0#0]  21.59,31.75 0 bottom
U$42  [#_D1#0]  21.59,29.21 0 bottom
U$43  [#_GND#0]  21.59,21.59 0 bottom
U$44  [#_3V3#0]  21.59,16.51 0 bottom
U$45  [#_#RST##0]  21.59,13.97 0 bottom
U$46  [#_D2#0]  21.59,26.67 0 bottom
U$47  [SEGGER_LOGO_7.5MM]  9.27,44.45 0 bottom
U$48  [#C4_#0]  1.27,34.29 0 bottom
U$49  [#C5_#0]  1.27,31.75 0 bottom
U$50  [#A4_#0]  1.27,36.83 0 bottom
U$51  [#A0_#0]  1.27,39.37 0 bottom
U$52  [#B0_#0]  1.27,41.91 0 bottom
U$53  [#B2_#0]  1.27,46.99 0 bottom
U$54  [#B1_#0]  1.27,44.45 0 bottom
U$55  [#VBAT_#0]  1.27,24.13 0 bottom
U$56  [#VUSB_#0]  1.27,29.21 0 bottom
U$57  [#EN_#0]  1.27,26.67 0 bottom
U$58  [MGM240P0]  11.43,26.67 0 bottom
U$59  [#MEAS#0]  20.32,10.29 90 bottom
U$60  [#CHG#0]  13.72,8.26 0 bottom
U$61  [#I2C#0]  5.08,6.86 90 bottom
U$62  [#D2_#0]  21.59,26.67 0 top
U$63  [#0#5A#0]  14.35,13.34 90 bottom
U$64  [#0#1A#0]  16.13,13.34 90 bottom
U$66  [MEAS81]  20.32,12.32 0 top
U$67  [CHG0]  11.43,14.61 90 top
U$68  [STAT0]  5.59,39.12 90 top
U$69  [#JP1#0]  19.94,19.05 90 bottom
U$70  [RST0]  10.54,19.05 90 top
U$71  [#_A5#TX#0]  21.59,49.53 0 bottom
U$72  [A80]  7.62,39.12 90 top
U$73  [#SDA#B4_#0]  1.27,52.07 0 bottom
U$74  [#SCL#B3_#0]  1.27,49.53 0 bottom
U$75  [ORDERING_INSTRUCTIONS]  38.1,50.8 0 top  (outside the outline)
U$76  [FOUR_LAYER_WARNING]  39.37,39.37 0 top  (outside the outline)
U$77  [#D3_#0]  21.59,24.13 0 top
U$78  [DBG0]  15.88,25.4 90 top
U$79  [#_C7#FREE#0]  21.59,52.07 0 bottom
U$80  [A0]  16.76,18.16 90 bottom
U$81  [B0]  16.76,20.07 90 bottom
U$82  [#D3#4]  18.92,24.13 0 bottom
U$83  [#CHG_I#0]  15.24,11.18 0 bottom
U$84  [SILICON_LABS_LOGO_9MM]  6.1,56.01 0 bottom
Y1  5.71,33.02 90 top

### Tracks (layer width: path | path; a pad name or v marks a point on that pad's centre or on a via)
3.3V  (via drill 0.3)
  Top 0.127: U3.J11 U3.H11 11.46,31.55 v11.86,31.55 | U3.C6 12.93,33.02 12.19,33.02 v11.43,33.78 11.18,34.04 11.18,34.77 U3.G3 | v14.1,27.69 14.1,27.56 R14.2 | U7.3 16.89,35.95 v17.14,36.2 17.14,36.33 R17.2 | U7.8 17.89,32.51 17.64,32.26 C5.1 v18.41,31.75 | R19.2 FB1.2
  Top 0.254: v3.81,9.4 v3.82,9.39 J3.2 | U1.15 7.93,42.47 v7.87,42.42 7.36,41.91 C2.1 | C1.1 4.58,15.07 v4.03,15.62 | U6.8 10.68,28.18 v10.16,28.7 10.16,28.57 9.53,27.93 C4.1 | FB1.2 6.86,26.67 v7.49,27.3
  Top 0.508: C14.1 16.38,17.14 15.97,17.55 U2.5 15.97,18.95 v15.88,19.05 v15.24,19.05
  PWR 0.127: 16.64,30.48 16.64,31.75
  Bottom 0.127: v3.81,9.4 3.81,8.64 4.19,8.26 I2C.2 | v3.45,6.81 2.56,6.81 2.12,7.25 PWR.2
  Bottom 0.254: J5.4 4.16,15.49 v4.03,15.62 | TP1.1 12.45,30.48 11.86,31.06 v11.86,31.55 | v7.49,27.3 8.13,27.94 R12.2 R16.2 R1.2
  Bottom 0.508: v6.99,29.84 v6.99,28.57
  other vias: 9.96,34.49 9.96,33.07
  pour PWR (isolate 0.203, rank 2): 0,0 22.86,0 22.86,58.42 0,58.42
  pour Top: 9.27,35.18 9.27,30.86 13.59,30.86 13.59,35.18
  pour Bottom (isolate 0.127): 9.02,35.69 9.02,32.89 11.94,32.89 11.94,34.16 10.29,34.16 10.29,35.69
!DBG_RESET!  (via drill 0.3)
  Top 0.127: U3.M7 U3.L8 10.08,32.52 10.22,32.66 10.95,32.66 v11.32,32.29
  Bottom 0.127: TP3.1 13.21,31.75 12.92,32.04 11.57,32.04 v11.32,32.29
!RESET!  (via drill 0.3)
  Top 0.127: U1.31 15.37,52.6 v15.24,52.47 | J7.3 10.79,40.01 10.79,40.89 11.56,41.66 14.61,41.66 19.05,37.22 19.05,35.03 19.3,34.78 19.3,32.51 19.56,32.26 19.56,30.16 19.81,29.91 19.81,24.38 v17.78,22.35 | U3.D1 12.93,38.38 v12.7,38.61 | S1.3 v13.5,19.05 S1.4
  Bottom 0.127: v15.24,52.47 13.1,52.47 8.26,47.62 8.26,45.59 9.53,44.31 9.53,40.01 J7.3 10.92,38.61 v12.7,38.61 | v13.5,19.05 14.77,20.32 16.81,20.32 | JP1.2 18.08,19.05 16.81,20.32 | v17.78,22.35 16.81,21.38 16.81,20.32
!SD_CS!/PA07  (via drill 0.3)
  Top 0.127: U1.16 8.93,42.51 7.62,41.2 v4.75,41.2 | v4.06,17.78 4.06,19.18 v3.3,19.94 | v4.06,25.4 R19.1
  Bottom 0.127: v4.06,17.78 4.15,17.69 J5.2 | v3.3,19.94 3.3,20.95 4.06,21.72 v4.06,25.4 4.88,26.22 4.88,41.08 v4.75,41.2
A0
  Bottom 0.127: JP1.1 18.41,20.94 19.68,22.21 D3_ISO.2 21.07,23.61 J1.24
DBG_CS  (via drill 0.3)
  Top 0.127: U3.B2 U3.B1 15.22,37.32 17.15,37.32 R17.1 18.25,36.23 v18.25,36.2 17.89,35.84 U7.1
  Bottom 0.127: v18.25,36.2 18.25,36.03 TP10.1
DBG_LED_PWR
  Top 0.127: D6.A 17.14,28.71 C12.1 15.74,29.21 U3.A12
DBG_PICO  (via drill 0.3)
  Top 0.127: U3.C3 12.92,34.51 v12.92,34.26 | U7.5 16.39,32.63 16.64,32.38 v17.14,32.38
  Bottom 0.127: TP7.1 17.78,33.02 v17.14,32.38 15.94,33.59 13.59,33.59 v12.92,34.26
DBG_POCI  (via drill 0.3)
  Top 0.127: U3.B3 U3.A4 15.01,34.52 v15.24,34.29 | v17.14,34.92 17.39,35.17 U7.2
  Bottom 0.127: v17.14,34.92 TP8.1 v15.24,34.29
DBG_RX  (via drill 0.3)
  Top 0.127: U3.A1 14.89,36.02 v14.99,36.12
  Bottom 0.127: v14.99,36.12 16.27,37.4 17.21,37.4 TP13.1
DBG_SCK  (via drill 0.3)
  Top 0.127: U3.A3 14.68,34.77 15.42,34.77 16.54,33.66 v17.14,33.66 16.57,33.66 16.57,33.45 16.89,33.12 U7.6
  Bottom 0.127: v17.14,33.66 TP9.1
DBG_SCL  (via drill 0.3)
  Top 0.127: U3.H13 10.93,29.54 v11.64,28.83 11.68,28.79 U6.6
  Bottom 0.127: v11.64,28.83 11.64,28.66 11.43,28.45 TP12.1 10.26,27.94 9.65,28.55 9.65,28.69 R16.1
DBG_SDA  (via drill 0.3)
  Top 0.127: U6.5 12.18,28.56 v12.45,28.83 12.45,29 U3.G13 U3.H12 U3.J12
  Bottom 0.127: v12.45,28.83 12.7,28.57 TP11.1 12.13,27.37 10.47,27.37 9.9,27.94 R12.1
DBG_SWCLK  (via drill 0.3)
  Top 0.127: U3.C10 v12.55,31.52 v12.55,31.53
  Bottom 0.127: v12.55,31.53 12.95,31.13 13.98,31.13 TP4.1
DBG_SWDIO  (via drill 0.3)
  Top 0.127: U3.B10 U3.A9 14.79,32.38 v15.24,32.38
  Bottom 0.127: v15.24,32.38 15.24,31.11 TP2.1
DBG_SWO  (via drill 0.3)
  Top 0.127: U3.A10 15.52,31.52 v15.75,31.75
  Bottom 0.127: v15.75,31.75 15.75,32.64 15.37,33.02 TP6.1
DBG_TX  (via drill 0.3)
  Top 0.127: U3.A2 14.9,35.52 v14.99,35.43
  Bottom 0.127: v14.99,35.43 16.38,36.83 TP14.1
DBG_WAKE  (via drill 0.3)
  Top 0.127: U3.E1 12.43,36.94 v12.45,36.96
  Bottom 0.127: v12.45,36.96 12.79,37.3 14.38,37.3 D8.A
DBG_WP  (via drill 0.3)
  Top 0.127: U3.F13 12.44,29.52 v12.7,29.52 13.34,28.88 R14.1 | v10.92,28.83 11.18,28.57 U6.7
  Bottom 0.127: v12.7,29.52 11.61,29.52 v10.92,28.83
EN  (via drill 0.3)
  Top 0.127: R2.2 19.3,19.55 18.85,20 U2.3 17.72,20 16.13,21.59 v14.86,21.59 | v9.53,21.59 6.64,24.47 3.47,24.47 J1.11
  Bottom 0.127: v9.53,21.59 v14.86,21.59
GND  (via drill 0.3)
  Top 0.127: 9.42,45.72 10.42,45.72 10.42,41.4 9.53,41.4 | v15.24,48.01 15.32,48.09 v18.53,48.09 v18.54,48.08 18.54,49.09 14.29,49.09 v14.22,49.02 | v18.54,50.1 v15.62,50.1 15.62,51.11 | v18.54,51.12 18.19,51.12 18.18,51.11 15.62,51.11 | v18.54,52.13 18.52,52.11 15.62,52.11 15.62,51.11 | v7.24,50.1 v4.32,50.1 4.32,50.73 4.68,51.09 7.21,51.09 v7.24,51.12 | v7.24,49.09 v7.23,49.09 4.32,49.09 v4.32,48.09 7.22,48.09 v7.24,48.07 7.24,47.09 v4.32,47.09 4.32,46.1 | v14.86,46.86 15.21,46.86 15.96,46.11 | v18.67,45.02 18.67,45.6 18.16,46.11 15.96,46.11 | v14.61,45.72 14.98,45.72 15.06,45.64 15.45,45.64 15.91,46.11 15.96,46.11 | v5.59,40.64 5.71,40.77 7.75,40.77 9.42,42.44 9.42,45.72 | v8.89,45.72 9.42,45.72 | U3.N12 U3.M11 | U3.K12 U3.K11 10.44,31.53 v10.72,31.53 | U3.L6 9.69,33.78 v9.91,33.78 9.67,33.78 U3.L5 | U3.J3 10.67,34.78 v10.67,34.54 10.67,34.76 U3.H3 | U3.C8 v12.71,32.52 v12.7,32.51 | v12.69,33.57 12.77,33.65 13.06,33.65 U3.C5 | 4.32,46.1 7.24,46.1 8,46.86 v10.16,46.86 | 4.32,46.1 4.32,44.9 v4.06,44.64 | v13.54,16.13 13.44,16.23 11.9,16.23 S1.2 | C5.2 16.12,31.22 v16.12,31.13 | v18.41,34.92 18.8,35.31 18.8,37.08 | v21.08,15.24 20.45,15.88 20.45,20.32 21.59,20.32 J1.25
  Top 0.254: v15.62,53.15 15.66,53.15 16.11,53.6 U1.32 | 9.53,41.4 9.53,40.64 J7.2 8.89,40.01 8.26,40.01 | U6.1 10.68,24.51 11.18,24.51 | 11.68,24.51 12.18,24.51 U6.4 | U6.2 11.18,24.51 | U6.3 11.68,24.51 | 11.18,24.51 11.68,24.51 | D3.2 v11.43,6.92 | v15.67,35.43 15.67,34.98 16.36,34.29 U7.EPAD
  Bottom 0.127: v3.12,19.2 2.83,19.49 2.83,20.84 3.56,21.57 v3.56,22.61 | v13.97,36.83 15.11,36.83 15.99,37.71 17.42,37.71 | v18.41,34.92 18.72,35.23 18.72,37.11
  Bottom 0.254: J5.GND3 12.06,10.95 v12.34,10.95 | v6.35,11.81 6.78,12.24 6.78,21.64 v6.86,21.72 | C19.2 12.7,33.02 | 12.7,33.02 TP5.1 | C20.2 C21.2 C18.2 C3.2 | v12.7,32.51 12.7,33.02 | v12.69,33.57 v12.7,33.56 12.7,33.02
  other vias: 12.19,50.04 11.18,49.02 13.21,50.04 10.16,48.01 7.24,53.15 4.06,57.59 18.8,57.59 18.8,56.58 18.8,55.56 18.8,53.53 21.08,40.64 21.08,43.18 18.92,46.48 21.08,48.26 16.26,43.05 20.19,52.39 22.23,53.28 21.59,57.15 21.08,50.8 4.32,56.07 2.54,51.5 1.27,57.15 7.11,42.8 1.78,35.56 5.08,41.91 3.81,10.41 21.08,38.1 3.56,7.87 1.78,50.8 0.64,53.28 0.58,22.89 8.76,6.99 5.97,1.27 13.46,9.14 14.99,6.99 22.23,3.81 21.72,9.02 11.02,11.94 17.27,19.05 17.4,15.24 14.61,10.54 2.41,22.48 21.08,45.72 1.78,33.02 6.86,23.37 1.78,25.4 1.78,27.94 0.58,19.96 0.58,15.65 0.58,12.98 0.71,4.98 9.78,9.53 18.54,9.53 17.27,4.57 4.01,16.66 8.18,19.71 4.14,6.6 7.37,33.02 6.86,35.53 7.37,30.48 5.71,23.88 4.32,37.34 19.05,27.56 18.8,25.78 14.86,40.64 18.41,30.48 12.7,20.32 10.16,22.23 5.71,31.24 9.91,25.91 13.97,29.21 12.95,25.91 16,27.18 10.41,36.55 9.02,36.58 10.44,29.36 5.84,43.69 17.02,43.69 11.43,53.09 10.16,53.09 8.89,53.09 12.7,53.09 13.97,53.09 3.17,27.94 3.3,33.02 3.3,40.64 2.03,19.68 2.03,15.88 2.03,12.7 5.08,19.68 13.59,24.77 8.64,24.77 8.64,23.75 12.7,23.75 4.32,27.94 4.32,35.53 21.08,25.4 0.64,8.89 17.53,20.95 18.03,23.37 14.48,19.05
  pour Top (isolate 0.127, rank 2): 0,0 22.86,0 22.86,58.42 0,58.42
  pour Bottom (isolate 0.127, rank 2): 0,0 22.86,0 22.86,58.42 0,58.42
  pour GND (isolate 0.127, rank 2): 0,0 22.86,0 22.86,58.42 0,58.42
LED/PA08
  Top 0.127: U1.17 9.8,43.97 9.8,42.33 7.47,39.99 D4.A
N$1
  Top 0.127: R11.2 5.07,38.1 5.21,38.24 D4.C
N$2  (via drill 0.3)
  Top 0.127: R13.2 5.46,6.21 5.34,6.1 v3.3,6.1
  Bottom 0.127: v3.3,6.1 1.89,6.1 PWR.1
N$3  (via drill 0.3)
  Top 0.127: D2.A 13.34,14.85 v13.34,14.61
  Bottom 0.127: v13.34,14.61 13.17,14.44 13.17,10.96 14.08,10.05 CHG.2
N$4  (via drill 0.3)
  Top 0.127: R6.2 16.5,14.11 v16.76,13.84
  Bottom 0.127: v16.76,13.84 16.76,13.46 16.28,12.98 CHG_I.1
N$5
  Top 0.127: U4.1 13.3,12.36 12.7,12.97 D2.C
N$6  (via drill 0.3)
  Top 0.127: R5.2 13.98,14.11 v13.72,13.84
  Bottom 0.127: v13.72,13.84 13.72,13.46 14.2,12.98 CHG_I.3
N$7
  Top 0.254: Q1.2 19.41,8.57 19.61,8.77 D1.C 20.32,9.53 MEAS.3
  Bottom 0.254: MEAS.1 MEAS.3
N$8
  Top 0.127: D5.A R13.1
N$9  (via drill 0.3)
  Top 0.127: U4.5 15.52,11.74 15.24,12.03 v15.24,13.84
  Bottom 0.127: v15.24,13.84 CHG_I.2
N$10  (via drill 0.3)
  Top 0.127: v16.26,10.54 16.39,10.54 R4.1
  Bottom 0.127: CHG.1 15.13,9.41 v16.26,10.54
N$11  (via drill 0.3)
  Top 0.127: R7.2 v8.26,7.62
  Bottom 0.127: v8.26,7.62 6.76,7.62 6.35,7.21 I2C.3
N$12  (via drill 0.3)
  Top 0.127: U3.L10 9.74,31.52 v9.91,31.69
  Bottom 0.254: R1.1 C3.1 9.86,31.75 v9.91,31.69
N$13  (via drill 0.3)
  Top 0.127: R8.2 v8.26,8.89
  Bottom 0.127: v8.26,8.89 6.76,8.89 6.35,9.3 I2C.1
N$14
  Top 0.127: J2.B5 13.18,6.76 13.34,6.92 R9.2
N$15
  Top 0.127: J2.A5 10.18,6.77 R10.2
N$16
  Top 0.185: D3.3 11.93,6.99 12.18,6.74 J2.B6 12.18,4.82 11.91,4.55 11.45,4.55 11.18,4.82 J2.A6
N$17
  Top 0.127: U3.J13 9.75,29.34
  Top 0.508: 9.75,29.34 9.44,29.34 C7.1
N$18  (via drill 0.3)
  Top 0.185: D3.1 10.93,6.99 10.68,6.74 J2.B7 v10.68,5.08 | J2.A7 v11.68,5.05
  Bottom 0.185: v11.68,5.05 10.71,5.05 v10.68,5.08
N$19
  Top 0.127: U3.M9 U3.M10 U3.N11 6.75,31.02 C9.1
  Top 0.254: FB1.1 5.72,27.18 5.72,27.45 C10.1 C8.1 C9.1
N$20  (via drill 0.3)
  Top 0.127: U3.L9 9.6,32.19 v10.41,32.19 | v15.93,27.94 R15.1
  Bottom 0.127: v15.93,27.94 14.15,29.72 13.21,29.72 12.83,30.1 12.32,30.1 11.3,31.11 11.3,31.62 10.86,32.06 10.54,32.06 v10.41,32.19
N$21
  Top 0.127: D6.C 17.84,25.21 17.84,26.86 17.64,27.05 R15.2
N$22
  Top 0.127: U3.N10 7.03,31.52 6.24,32.31 Y1.1
N$23
  Top 0.127: Y1.3 5.19,33.68 5.85,33.02 6.67,33.02 7.67,32.02 U3.N9
N$24  (via drill 0.3)
  Top 0.127: v16,38.86 16,38.47 R18.2
  PWR 0.127: v16,38.86 17.78,37.08 17.78,31.75 v17.14,31.11
  Bottom 0.127: LP.1 v17.14,31.11 | v16,38.86 16,38.67 D8.C
N$25
  Top 0.127: U3.L1 9.53,36.12 9.53,37.08 8.93,37.68 8.4,37.68 7.55,36.83 R20.1
N$26
  Bottom 0.127: R21.1 20.32,45.72 J1.15
N$27
  Top 0.127: U2.1 18.85,18.1 19.3,18.55 R2.1
  Top 0.254: U2.1 18.95,18.1 19.55,17.5 C13.1 19.55,13.2 19.05,12.7 MEAS.4
  Bottom 0.254: MEAS.4 MEAS.2
N$28
  Bottom 0.127: J1.28 18.41,17.14 JP1.3
PA00
  Top 0.127: J1.6 2.54,40.64 2.54,42.82 2.79,43.08 2.79,45.26 3.05,45.51 3.05,47.69 3.3,47.94 3.3,50.12 4.78,51.6 U1.7
PA04
  Top 0.127: U1.11 3.53,47.6 3.3,47.37 3.3,45.4 3.05,45.15 3.05,42.97 2.79,42.72 2.79,40.51 2.41,40.13 2.41,37.97 J1.7
PB00
  Top 0.127: J1.5 2.54,43.18 2.54,45.36 2.79,45.62 2.79,47.8 3.05,48.05 3.05,50.23 4.32,51.5 4.32,52.07 4.85,52.6 U1.6
PB01
  Top 0.127: J1.4 2.54,45.72 2.54,47.9 2.79,48.16 2.79,50.34 4.06,51.61 4.06,52.83 4.83,53.6 U1.5
PB02
  Top 0.127: J1.3 2.54,48.26 2.54,50.44 3.81,51.71 3.81,53.59 4.82,54.6 U1.4
PC00
  Top 0.127: U1.22 14.93,43.13 20.32,37.74 20.32,35.56 J1.20
PC01
  Top 0.127: U1.24 16.14,45.6 15.62,45.09 15.62,42.8 J1.19
PC07
  Top 0.127: U1.30 21.12,51.6 J1.13
PD00
  Top 0.127: J1.21 20.32,33.02 20.32,35.2 20.07,35.45 20.07,37.64 15.03,42.67 14.48,42.67 13.93,43.22 U1.21
PD01
  Top 0.127: J1.22 20.32,30.48 20.32,32.66 20.07,32.91 20.07,35.1 19.81,35.35 19.81,37.53 14.92,42.42 13.72,42.42 12.93,43.2 U1.20
PD02
  Top 0.127: J1.23 20.32,27.94 20.32,30.12 20.07,30.38 20.07,32.56 19.81,32.81 19.81,34.99 19.56,35.24 19.56,37.42 14.82,42.16 12.95,42.16 11.93,43.19 U1.19
PD03  (via drill 0.3)
  Top 0.127: v20.32,25.65 20.32,27.58 20.07,27.84 20.07,30.02 19.81,30.27 19.81,32.45 19.56,32.7 19.56,34.88 19.3,35.14 19.3,37.32 14.71,41.91 12.27,41.91 10.93,43.25 U1.18
  Bottom 0.127: v20.32,25.65 20.32,25.03 19.94,24.65 D3_ISO.1
PICO/PC03
  Top 0.127: U1.26 18.69,47.6 19.81,46.48 19.81,43.69 J1.17
  Bottom 0.127: J1.17 19.71,40.03 19.71,27.46 16.51,24.26 6.99,24.26 5.74,23.01 5.74,17.04 5.29,16.59 J5.3
POCI/PC06
  Top 0.127: J1.16 20.45,45.59 20.45,49.4 19.25,50.6 U1.29
  Bottom 0.127: J1.16 18.97,41.83 18.97,28.25 16,25.27 6.35,25.27 5.08,24 5.08,20.45 3.17,18.54 3.17,13.32 4.31,12.19 J5.7
PTI_DATA/PC04  (via drill 0.3)
  Top 0.127: v14.73,48.51 14.82,48.6 U1.27 | v8.59,37.21 8.43,37.05 U3.N1 3,36.02 J1.8
  Bottom 0.127: v14.73,48.51 13.97,47.75 J7.10 14.63,39.98 14.63,38.63 13.6,37.59 8.97,37.59 v8.59,37.21
PTI_FRAME/PC05  (via drill 0.3)
  Top 0.127: v13.72,49.53 13.79,49.6 U1.28 | U3.N2 7.92,35.52 v7.41,35.01 4.53,35.01 J1.9
  Bottom 0.127: v13.72,49.53 13.34,49.15 13.34,40.01 J7.9 13.97,38.83 13.24,38.1 8.82,38.1 7.41,36.69 v7.41,35.01
RX/PA06  (via drill 0.3)
  Top 0.127: U1.13 7.18,45.6 7.96,46.38 v9.14,46.38 14.98,46.38 v15.25,46.11 | J7.4 9.53,40.01 9.53,38.99 9.14,38.61 8.26,38.61 7.11,37.47 5.85,37.47 R20.2
  Bottom 0.127: v9.14,46.38 10.16,45.36 J7.4 | v15.25,46.11 15.63,45.73 16.63,45.73 R21.2
SCK/PC02
  Top 0.127: U1.25 17.21,46.73 17.92,46.73 19.14,45.5 19.14,41.82 J1.18
  Bottom 0.127: J1.18 20.45,38.23 20.45,26.67 17.02,23.24 7.49,23.24 6.38,22.12 6.38,14.88 5.88,14.39 J5.5
SCL/PB03  (via drill 0.3)
  Top 0.127: J1.2 3.56,51.82 3.56,54.36 4.8,55.6 U1.3 | v2.92,7.37 2.94,7.39 J3.4 5.87,7.39 6.1,7.62 R7.1 6.99,8.12 6.99,9.96 6.69,10.25 6.26,10.25 6.01,10.5 6.01,10.99 6.32,11.31 U5.7
  Bottom 0.127: v2.92,7.37 1.52,8.76 1.52,22.35 2.41,23.24 2.41,48.39 J1.2
SDA/PB04  (via drill 0.3)
  Top 0.127: J1.1 2.79,53.59 2.79,55.37 4.02,56.6 U1.2 | v2.92,8.64 3.17,8.39 J3.3 5.99,8.39 R8.1 6.49,9.54 v6.24,9.78 | v6.48,10.79 6.49,10.81 U5.8
  Bottom 0.127: v2.92,8.64 2.54,9.02 2.54,21.92 3.05,22.43 3.05,25.65 3.81,26.42 3.81,44.2 3.56,44.45 3.56,49.78 J1.1 | v6.24,9.78 6.24,10.56 v6.48,10.79
SHLD  (via drill 0.3)
  other vias: 14.73,2.16
  pour Top: 6.99,5.33 6.99,0 15.88,0 15.88,5.33
  pour Bottom: 15.88,5.33 15.88,0 6.99,0 6.99,5.33
SWCLK/PA01  (via drill 0.3)
  Top 0.127: U1.8 12.65,50.6 v12.7,50.55 | U3.C1 13.43,36.04 13.43,39.91 J7.8
  Bottom 0.127: v12.7,50.55 J7.8
SWDIO/PA02  (via drill 0.3)
  Top 0.127: U1.9 11.61,49.6 v11.68,49.53 | v12.24,34.13 12.24,34.33 U3.D3 U3.C2 | v11.71,37.03 11.71,38.38 J7.7
  Bottom 0.127: v11.68,49.53 12.06,49.15 12.06,40.01 J7.7 | v11.71,37.03 12.24,36.5 v12.24,34.13
SWO/PA03  (via drill 0.3)
  Top 0.127: U1.10 10.58,48.6 v10.67,48.51 | J7.6 12.06,40.01 12.06,39.16 10.95,38.04 v10.95,37.03 | U3.E3 12.41,35.02 11.94,34.54 v11.68,34.54
  Bottom 0.127: v10.67,48.51 11.43,47.75 J7.6 | v11.68,34.54 11.68,36.29 v10.95,37.03
TX/PA05  (via drill 0.3)
  Top 0.127: U1.12 7.33,46.6 8.15,47.42 v9.68,47.42 15.32,47.42 v15.49,47.24 | U3.L2 U3.K1 9.93,37.87 J7.5
  Bottom 0.127: v9.68,47.42 10.44,47.42 10.79,47.07 10.79,40.01 J7.5 | v15.49,47.24 15.75,46.99 19.05,46.99 J1.14
USB_N
  Top 0.185: D3.6 10.93,9.18 11.53,9.78 11.53,12.22 10.86,12.88 10.86,21.85 11.81,22.79 12.57,22.79 15.11,25.33 15.11,28.84 U3.B13
USB_P
  Top 0.185: D3.4 11.93,9.25 11.84,9.34 11.84,12.35 11.18,13.02 11.18,21.72 11.94,22.48 12.7,22.48 15.43,25.2 15.43,29.02 U3.A13
V_BATT  (via drill 0.3)
  Top 0.127: U5.2 10.04,11.31 C17.1 10.03,11.81 U5.3
  Top 0.254: v11.03,10.92 10.91,10.92 C17.1 | v12.34,10.18 12.59,10.18 12.93,9.85 U4.3 14.4,9.85 C16.1 16.63,7.62 Q1.3 | J4.2 7.49,18.78 v7.49,19.71 7.49,21.9 6.16,23.24 2.16,23.24 J1.12
  PWR 0.254: v12.34,10.18 11.77,10.18 v11.03,10.92 7.49,14.46 v7.49,19.71
V_USB  (via drill 0.3)
  Top 0.127: D1.A 21.07,6.47 R3.2 | U3.B12 U3.A11 15.08,31.02 v15.62,30.48 | R4.2 16.74,10.29 16.29,9.85 U4.4
  Top 0.254: J2.VBUS2 13.88,6.64 14.76,7.52 15.34,7.52 16.19,6.67 17.53,6.67 | 17.53,6.67 Q1.1 | Q1.1 19.41,6.67 19.61,6.47 D1.A | U4.4 16.16,9.85 17.53,8.48 17.53,6.67 | C15.1 18.78,5.96 Q1.1 | D3.5 v11.43,8.97 | v15.62,30.48 C11.1 | 12.42,4.09 v12.4,4.06 | 11.43,4.06 v11.43,4.05
  Top 0.508: J2.VBUS1 8.98,5.55 v9.8,4.72 v10.46,4.06 11.43,4.06 v12.4,4.06 | J2.VBUS2 13.88,5.55 v13.06,4.72 12.42,4.09
  PWR 0.254: v11.43,8.97 9.8,7.34 v9.8,4.72 | J1.10 9.53,29.21 10.41,30.1 15.24,30.1 v15.62,30.48
  Bottom 0.127: LP.2 15.89,28.69 15.62,28.96 v15.62,30.48
  pour PWR (isolate 0.127): 0,30.48 2.54,30.48 3.81,29.21 3.81,22.86 3.05,22.1 3.05,6.35 15.88,6.35 15.88,0 0,0

### Text on the board
Top: 1
GND: 2
PWR: 3
Bottom: 4 | v10
Measures: Units: inches
tDocu: ENIG Finish | Dryw Wade